# Altium project SAST_PCB_V2_Test_Beta.PrjPcb (part 1 of 2)
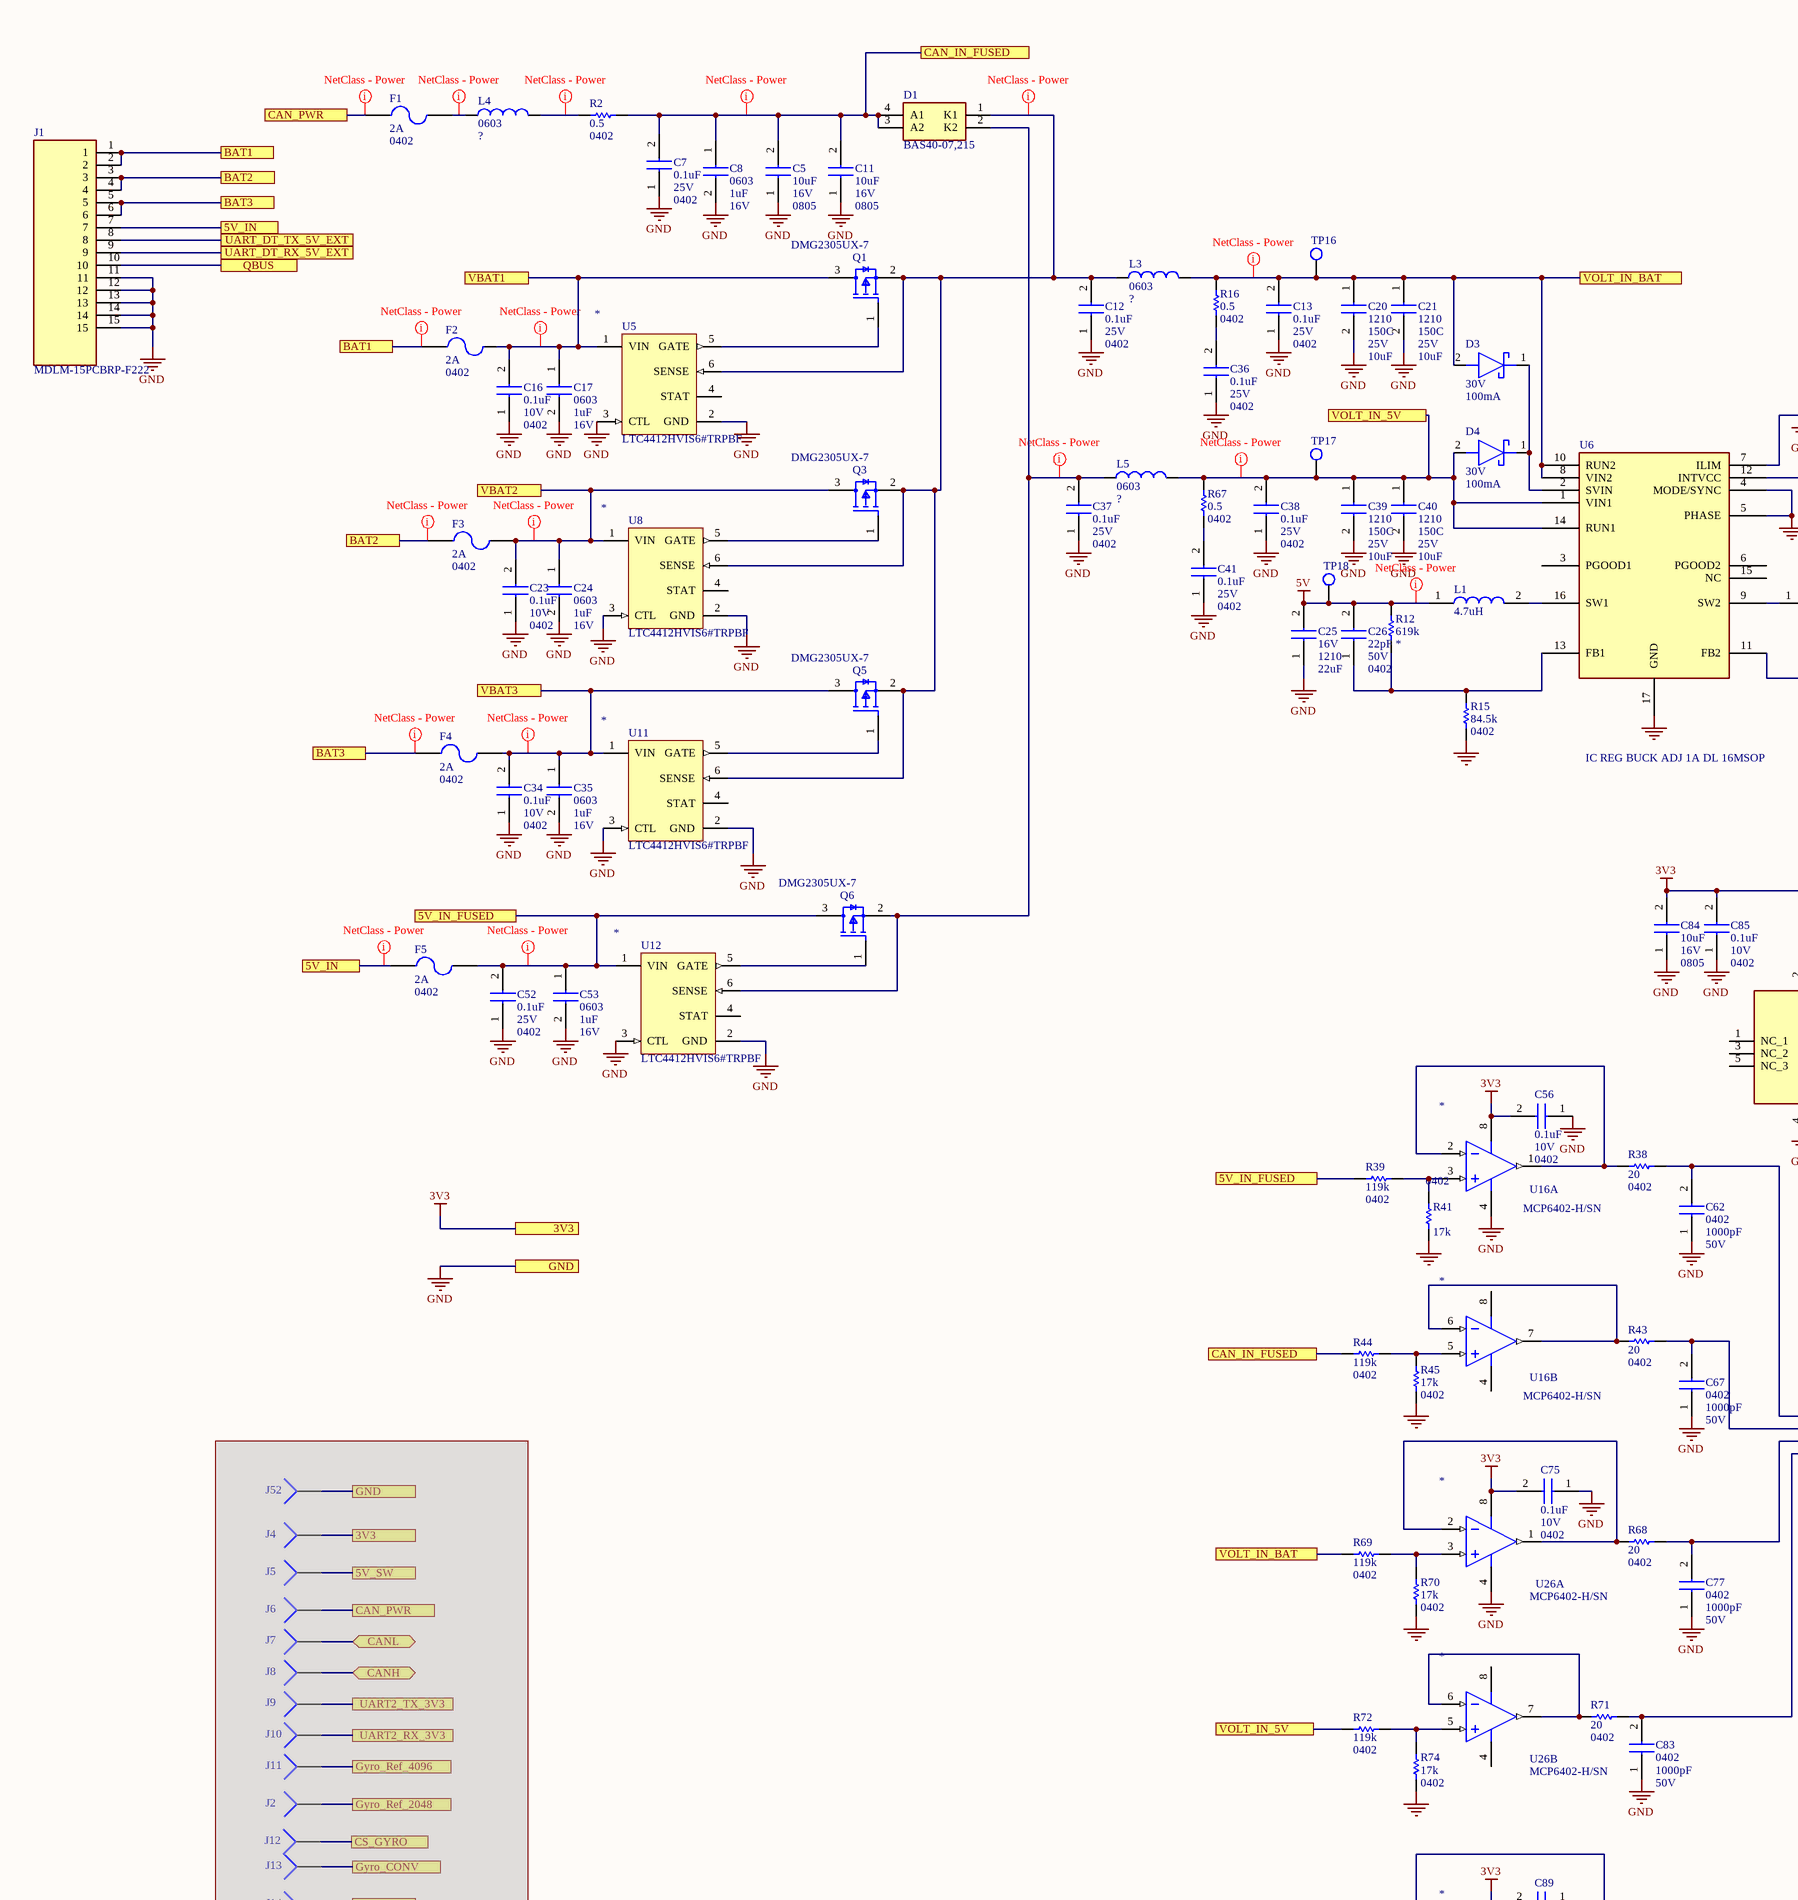
[diagram p0: SAST_PCB_V2B_Test_Beta_Main.SchDoc, top left]
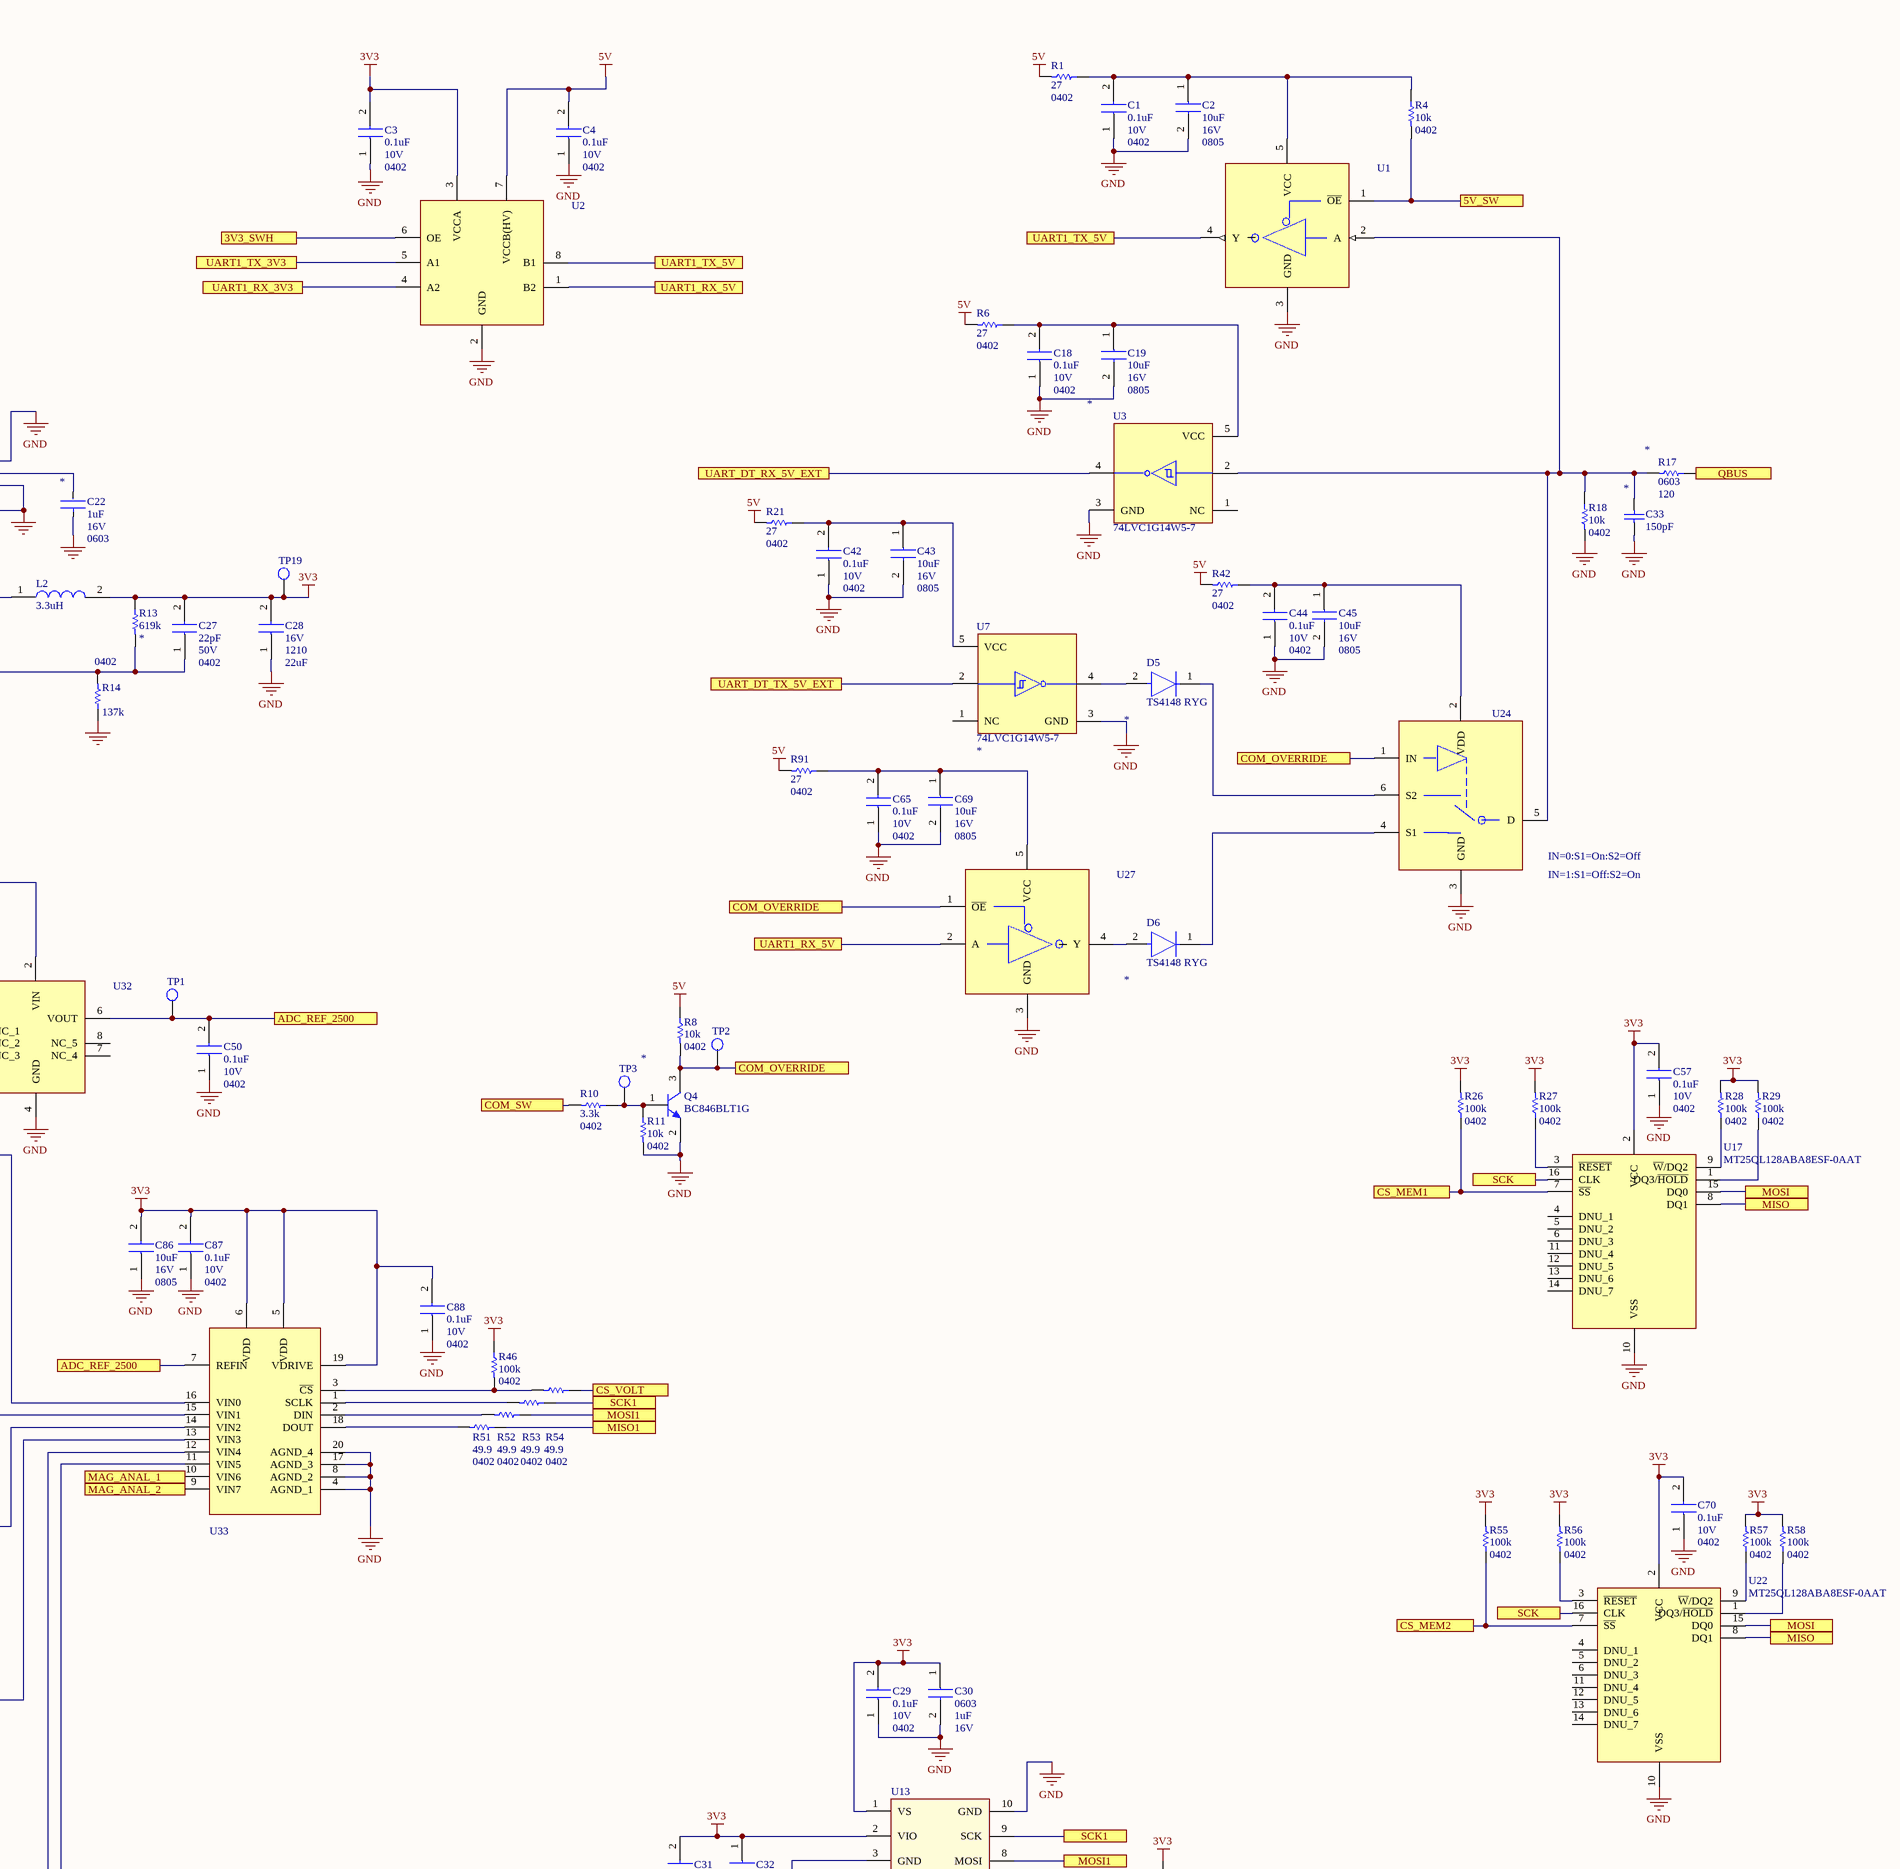
[diagram p1: SAST_PCB_V2B_Test_Beta_Main.SchDoc, top middle]
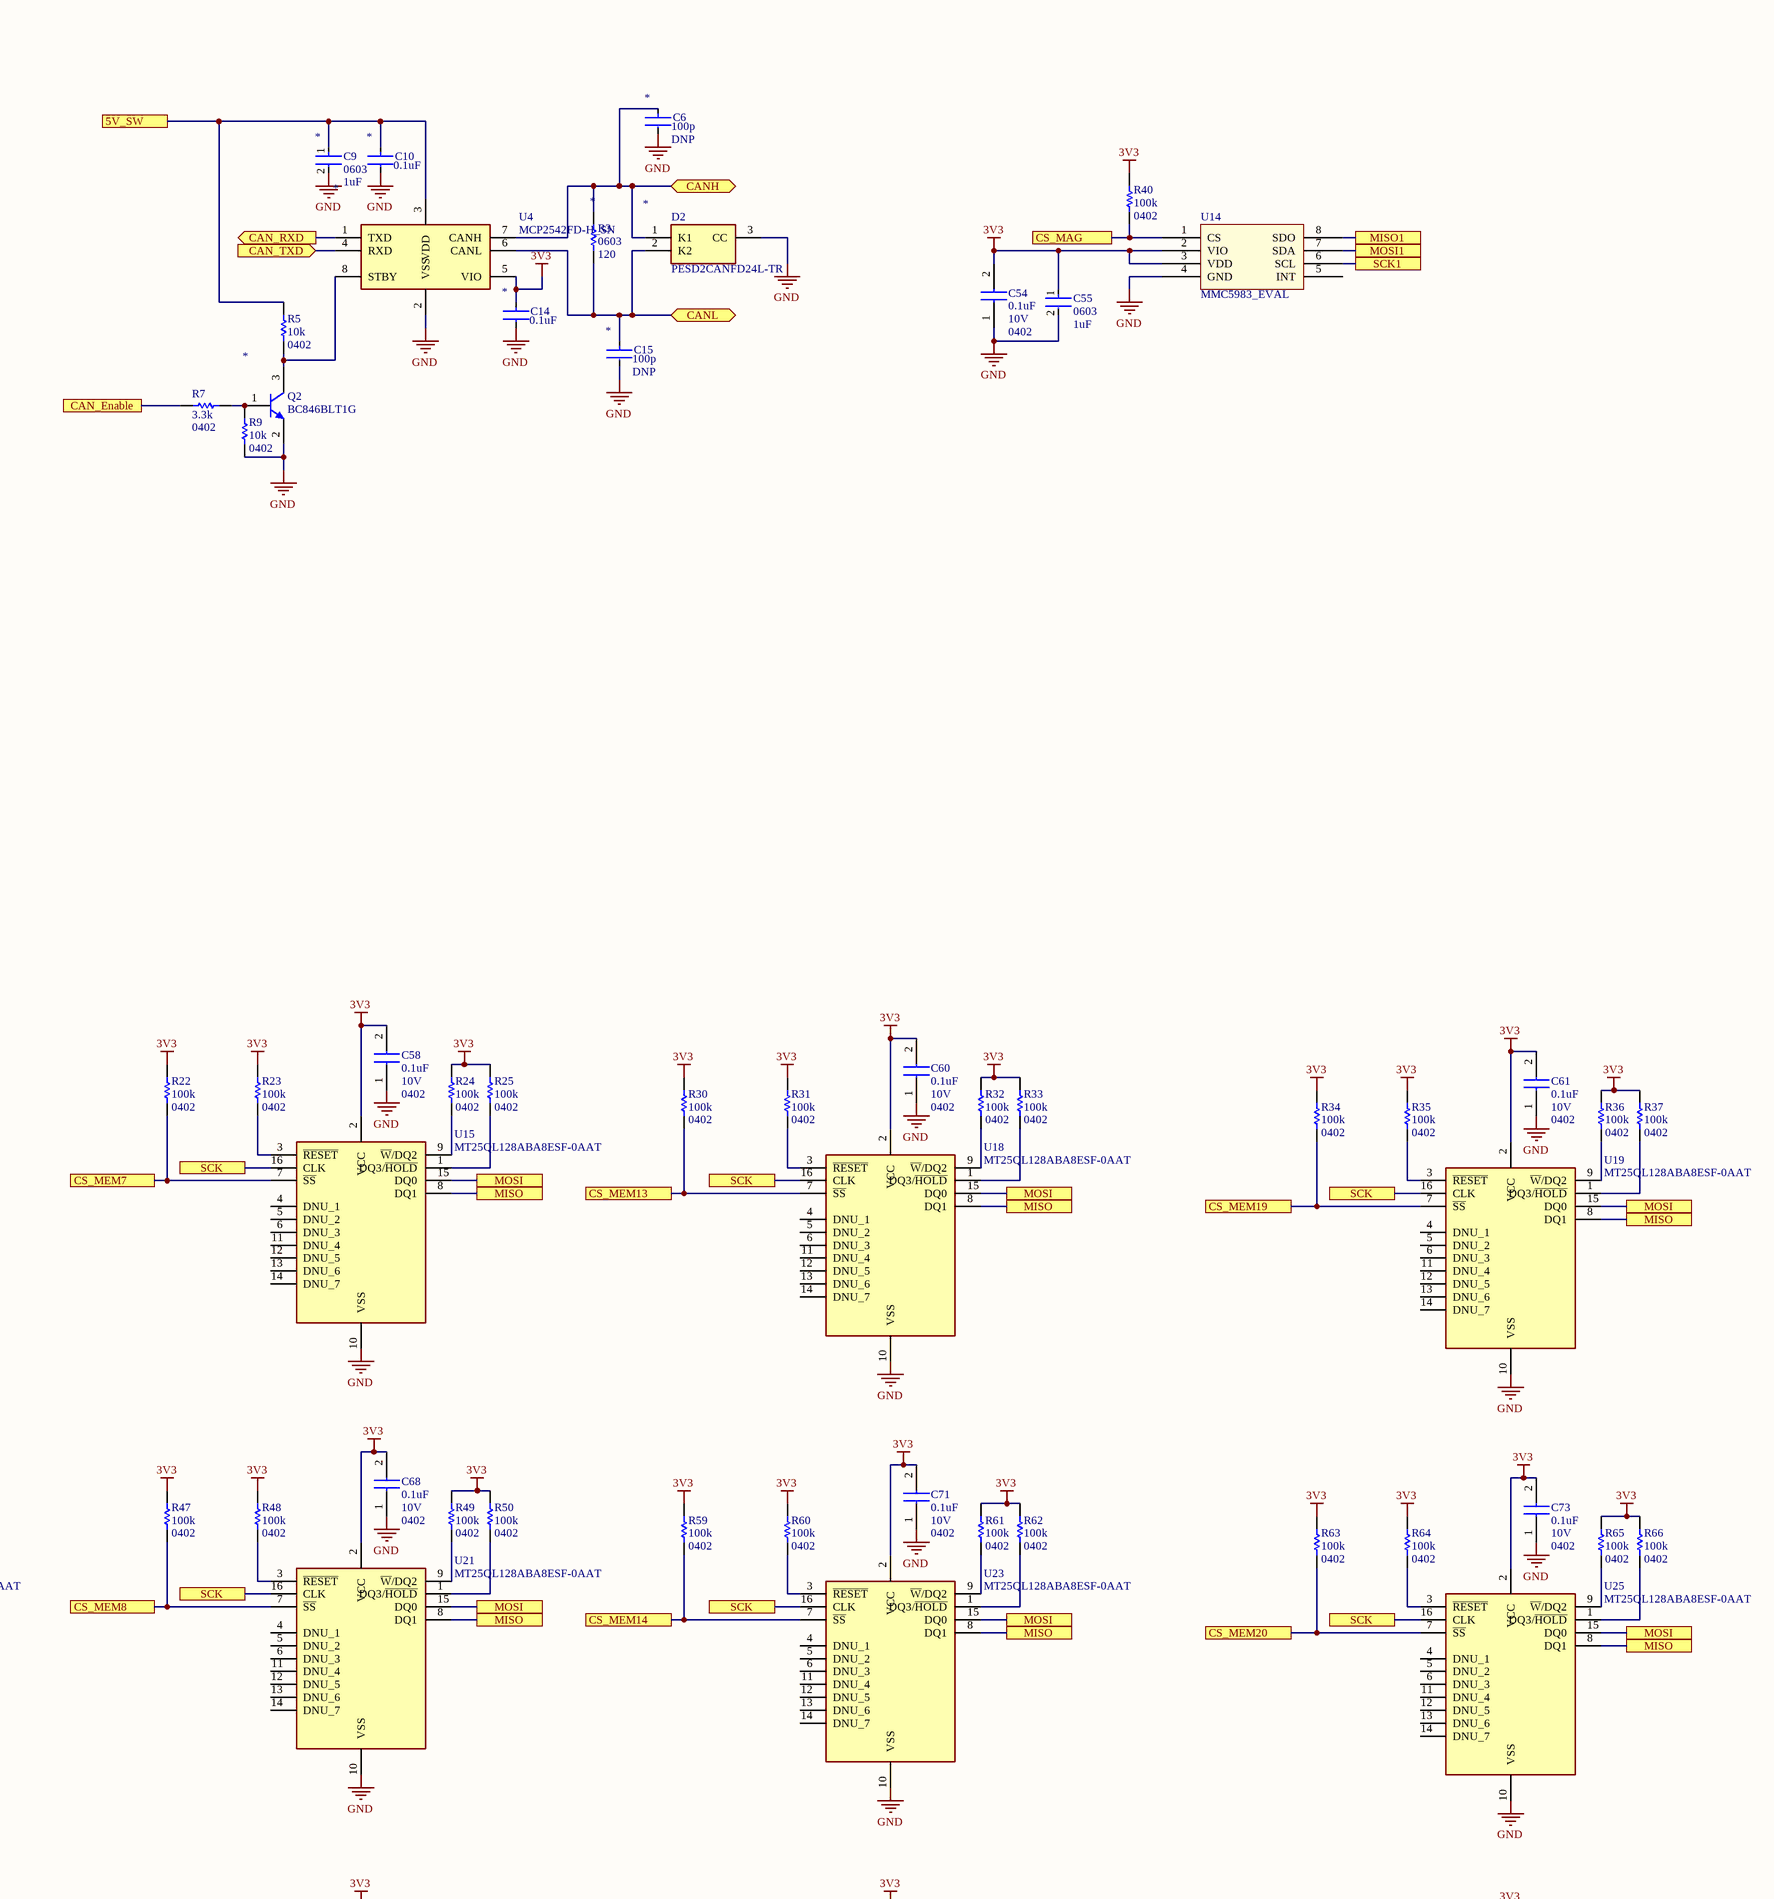
[diagram p2: SAST_PCB_V2B_Test_Beta_Main.SchDoc, top right]
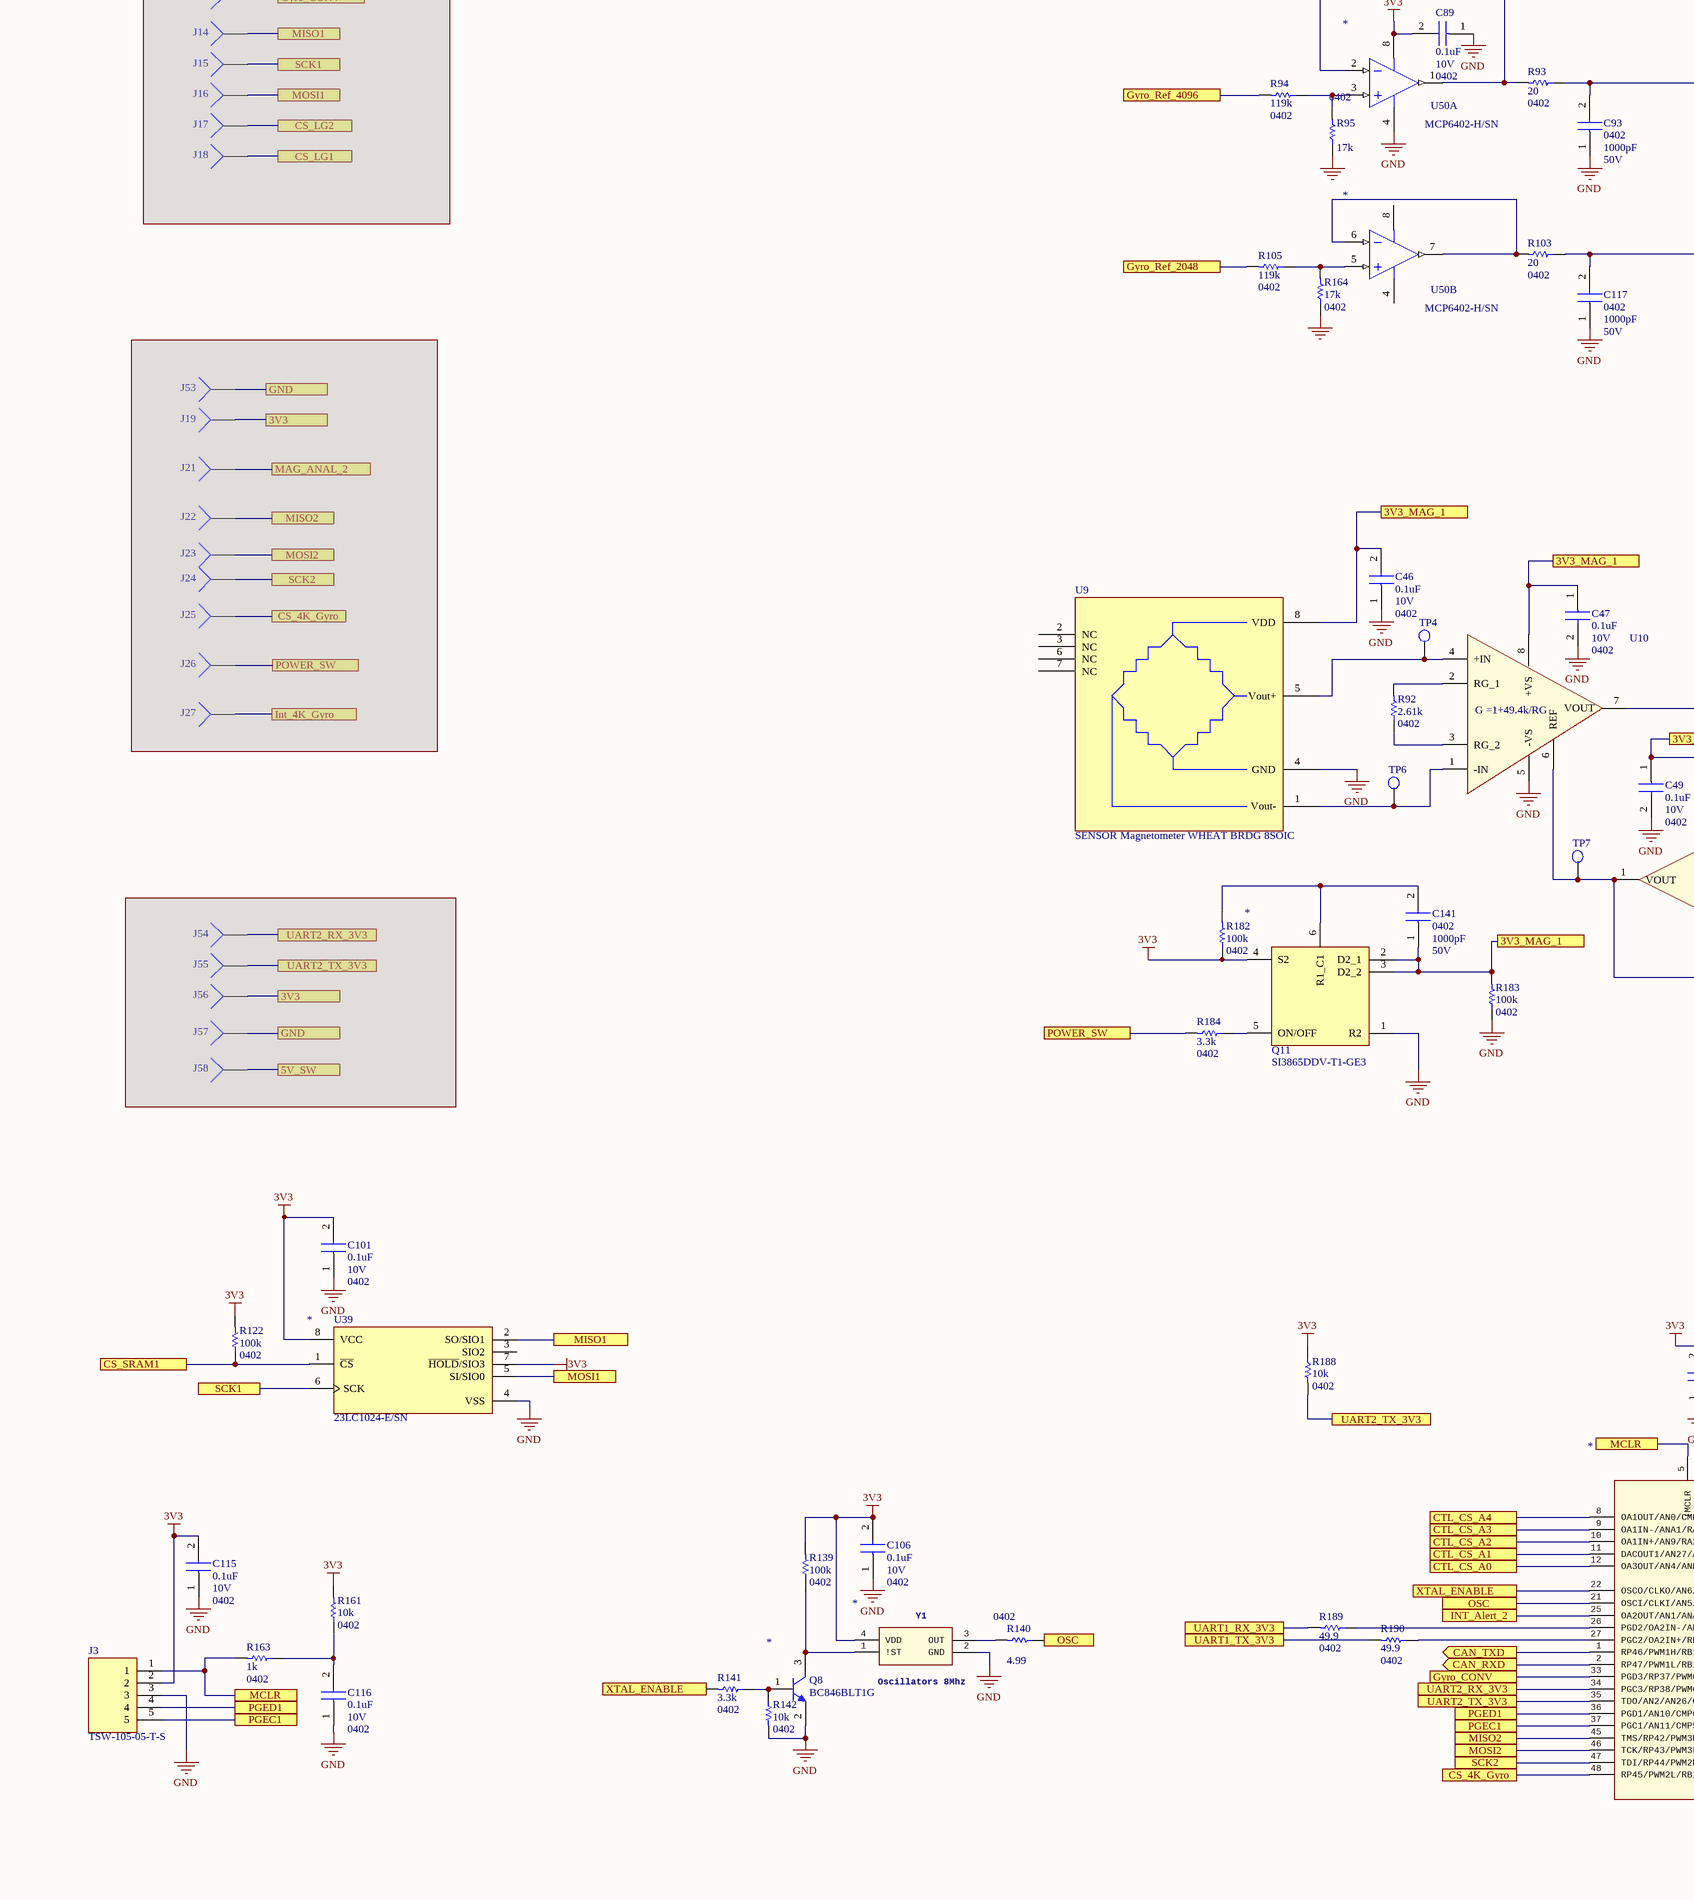
[diagram p3: SAST_PCB_V2B_Test_Beta_Main.SchDoc, bottom left]
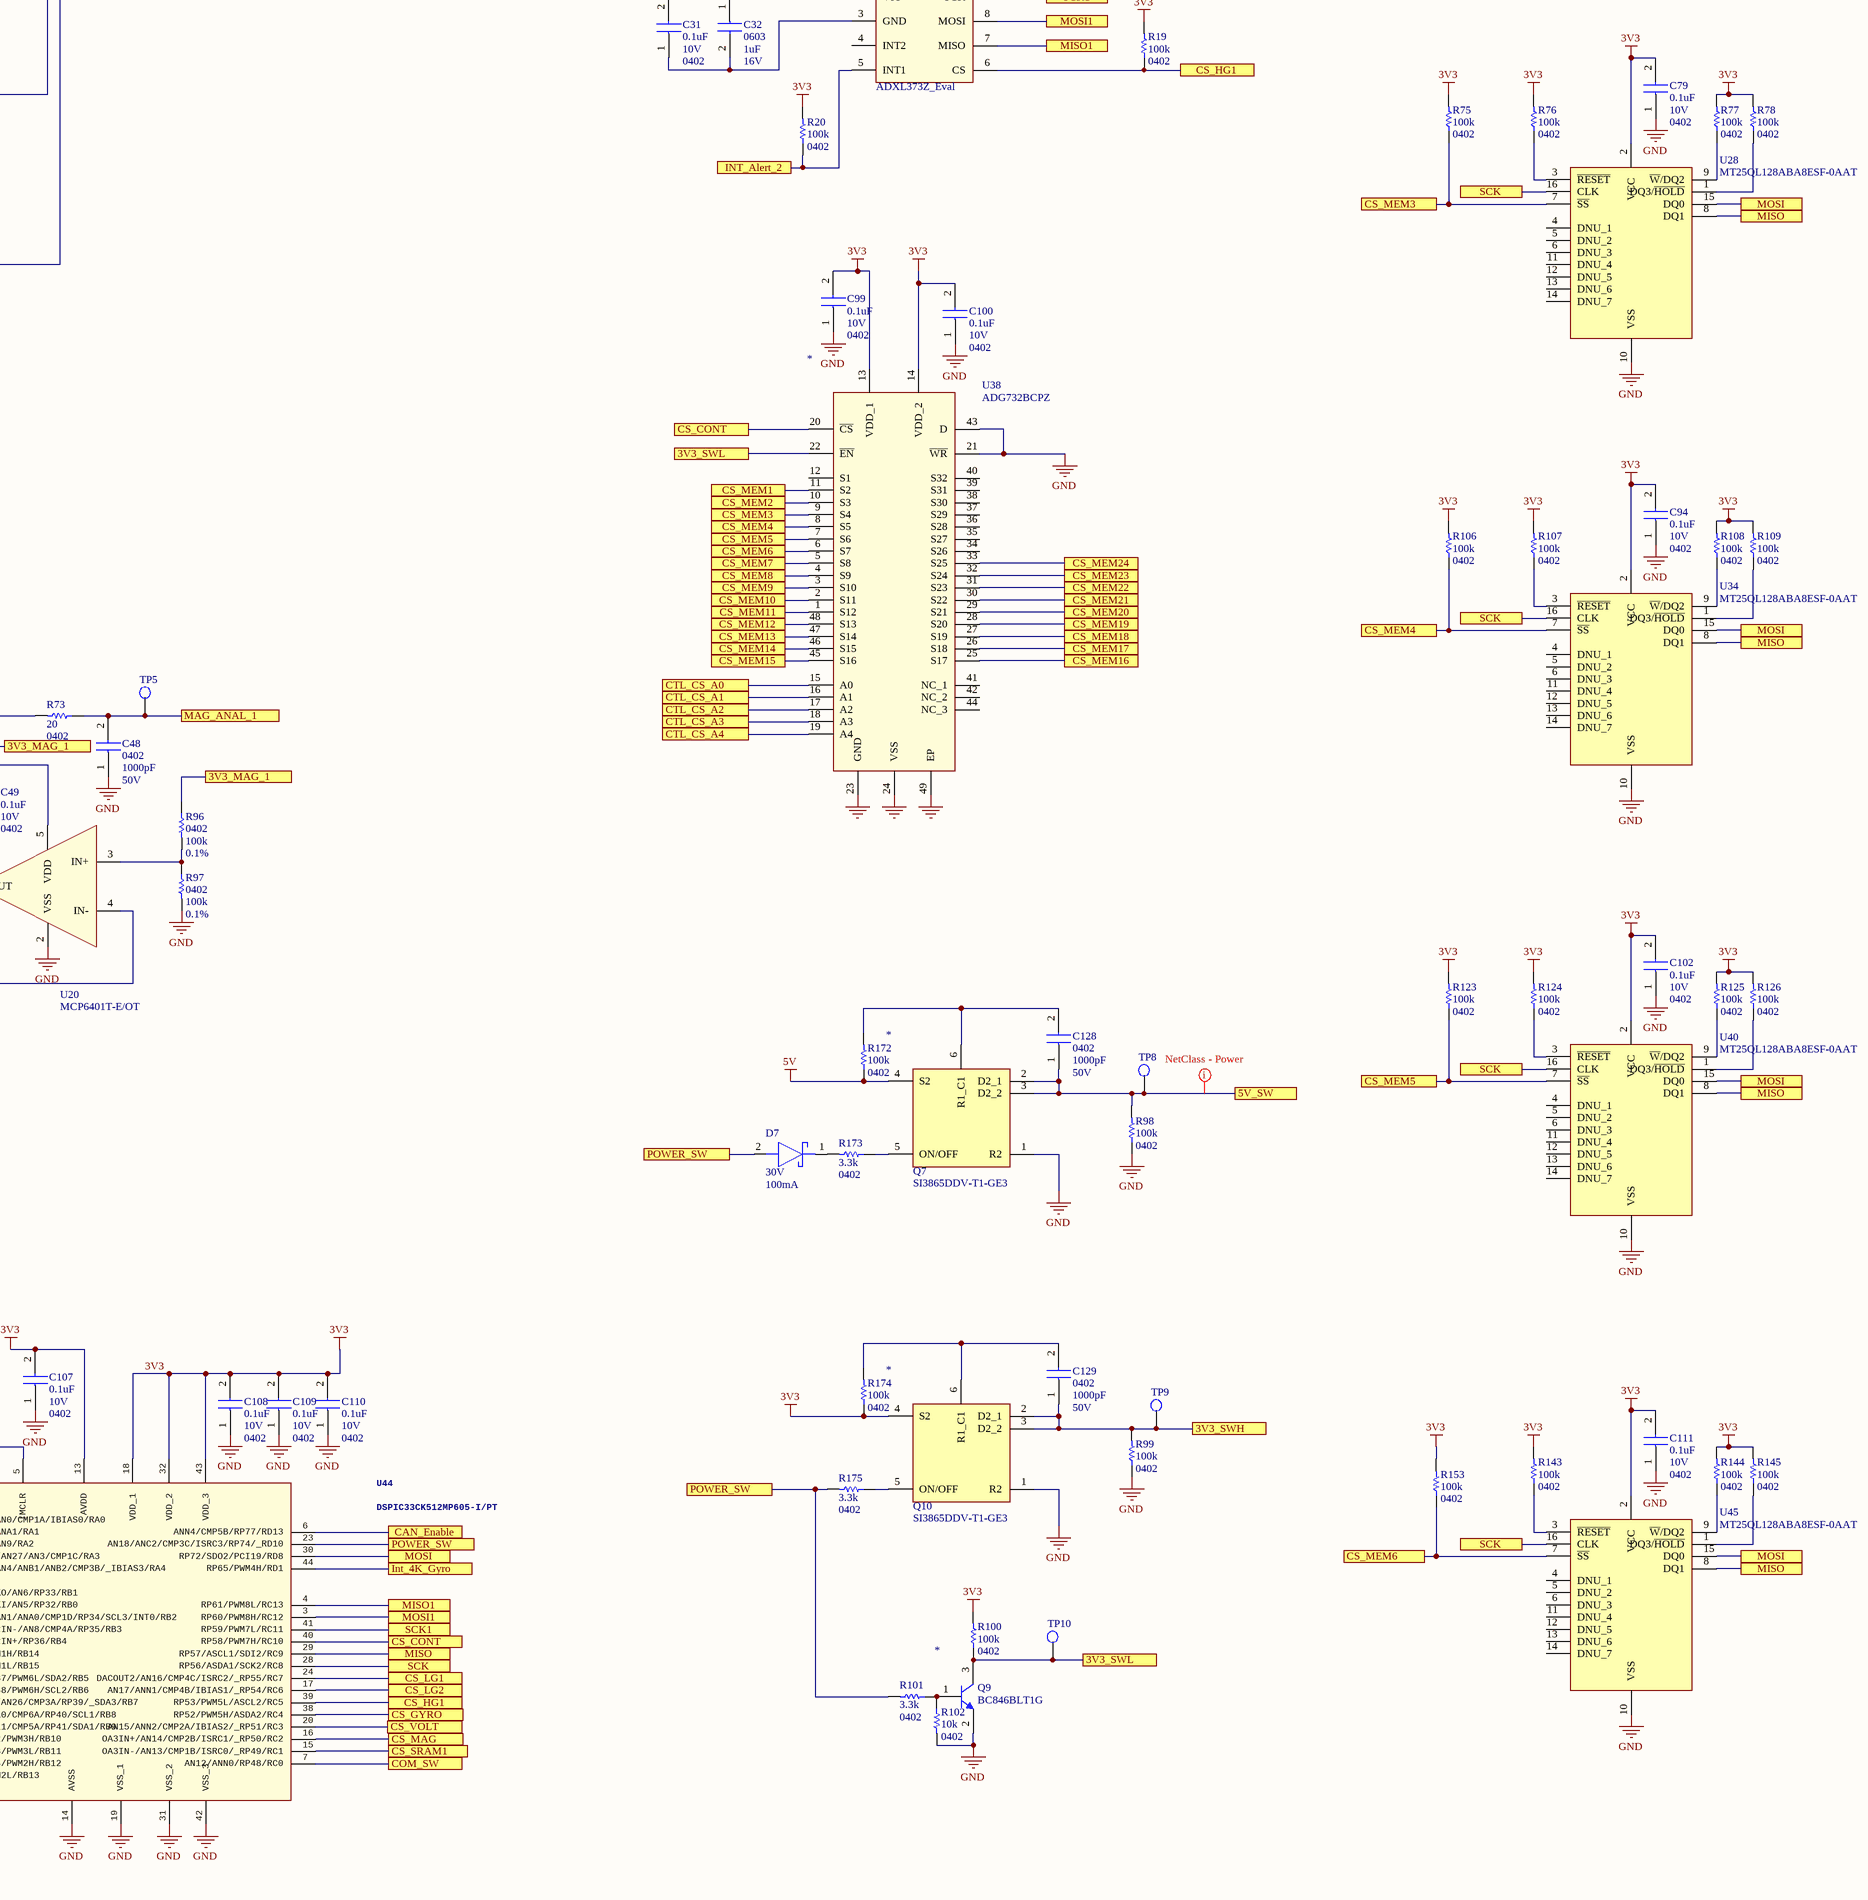
[diagram p4: SAST_PCB_V2B_Test_Beta_Main.SchDoc, bottom middle]
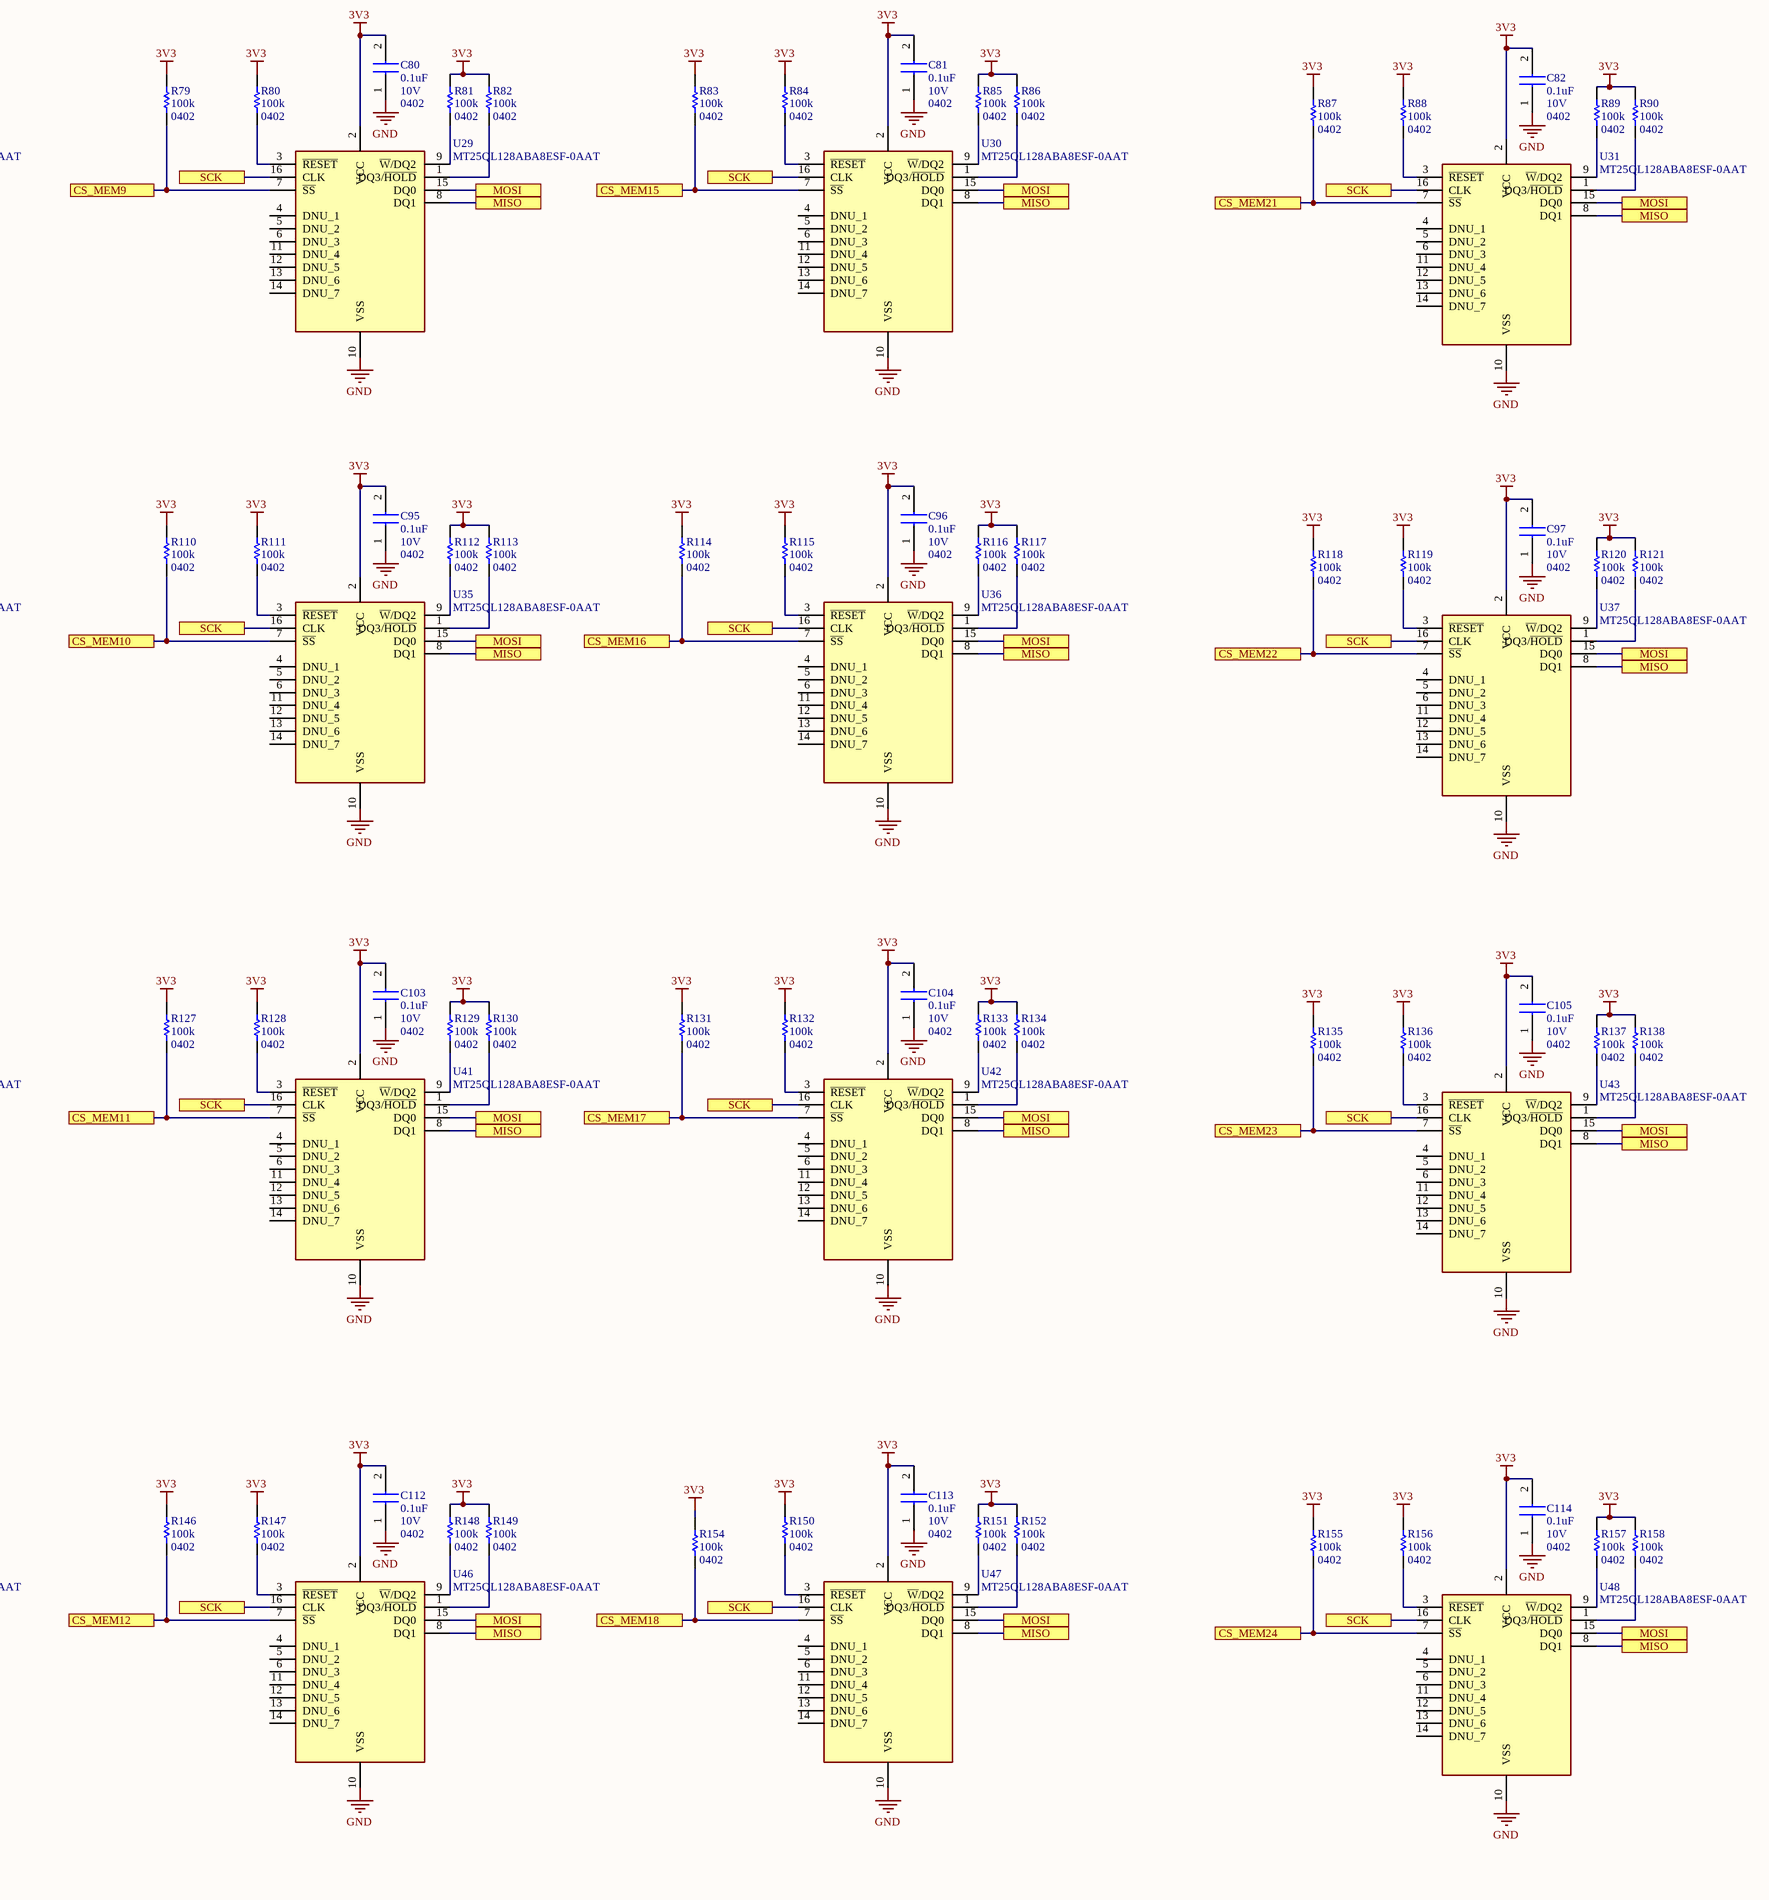
[diagram p5: SAST_PCB_V2B_Test_Beta_Main.SchDoc, bottom right]
1 sheet, 402 parts. Net scope: flat (ports and power ports of the same name join across sheets).
Board file: SAST_PCB_V2B_Test_Beta_Main.PcbDoc

## Sheet SAST_PCB_V2B_Test_Beta_Main.SchDoc
size A0; SheetNumber: 1; SheetTotal: 1; SPICEModelCacheFRIUEEDA: <root> / <DocumentId>FRIUEEDA</DocumentId> / <CacheFrame Number="0"> / <Model Name="fuse" Kind="CKT"> / <Text>.SUBCKT FUSE 1 2 PARAMS: CURRENT=1 RESISTANCE=1m / SW1 1 2 3 0 SMOD OFF / BNLV 3 0 V=(abs(v(1,2))) / .MODEL SMOD SW (VT={(CURRENT*RESISTANCE)} RON=1g ROFF={RESISTANCE}) / .ENDS FUSE</Text> / </Model> / </CacheFrame> / </root>

### Parts
C1  value 0.1uF  Voltage: 10V  Case/Package: 0402  [0402_DSP]  (hidden comment: CAP CER .1UF 10V X8M 0201)
C2  value 10uF  Voltage: 16V  Case/Package: 0805  [0805_DSP]  (hidden comment: CAP CER 10UF 16V X8M 0805)
C3  value 0.1uF  Voltage: 10V  Case/Package: 0402  [0402_DSP]  (hidden comment: CAP CER .1UF 10V X8M 0201)
C4  value 0.1uF  Voltage: 10V  Case/Package: 0402  [0402_DSP]  (hidden comment: CAP CER .1UF 10V X8M 0201)
C5  value 10uF  Voltage: 16V  Case/Package: 0805  [CAPC2012X140N]  (hidden comment: CAP CER 10UF 16V X8M 0805)
C6  value 100p  Manufacturing: DNP  [FP-GCM155-0_05-IPC_B]  (hidden comment: GCM155L81E104KE02D)
C7  value 0.1uF  Voltage: 25V  Case/Package: 0402  [0402_DSP]  (hidden comment: CAP CER 0.1UF 25V X8L 0402)
C8  value 1uF  Case/Package: 0603  Voltage: 16V  [0603_DSP]  (hidden comment: CAP CER 1UF 16V X8L 0603)
C9  0603  value 1uF  [FP-GCG188-0_2-IPC_A]
C10  value 0.1uF  [FP-GCM155-0_05-IPC_B]  (hidden comment: GCM155L81E104KE02D)
C11  value 10uF  Voltage: 16V  Case/Package: 0805  [CAPC2012X140N]  (hidden comment: CAP CER 10UF 16V X8M 0805)
C12  value 0.1uF  Voltage: 25V  Case/Package: 0402  [0402_DSP]  (hidden comment: CAP CER 0.1UF 25V X8L 0402)
C13  value 0.1uF  Voltage: 25V  Case/Package: 0402  [0402_DSP]  (hidden comment: CAP CER 0.1UF 25V X8L 0402)
C14  value 0.1uF  [FP-GCM155-0_05-IPC_B]  (hidden comment: GCM155L81E104KE02D)
C15  value 100p  Manufacturing: DNP  [FP-GCM155-0_05-IPC_B]  (hidden comment: GCM155L81E104KE02D)
C16  value 0.1uF  Voltage: 10V  Case/Package: 0402  [0402_DSP]  (hidden comment: CAP CER .1UF 10V X8M 0201)
C17  value 1uF  Case/Package: 0603  Voltage: 16V  [0603_DSP]  (hidden comment: CAP CER 1UF 16V X8L 0603)
C18  value 0.1uF  Voltage: 10V  Case/Package: 0402  [0402_DSP]  (hidden comment: CAP CER .1UF 10V X8M 0201)
C19  value 10uF  Voltage: 16V  Case/Package: 0805  [0805_DSP]  (hidden comment: CAP CER 10UF 16V X8M 0805)
C20  value 10uF  Case/Package: 1210  Temperature: 150C  Voltage: 25V  [CAPC3225X280N]  (hidden comment: CAP CER 10UF 25V X8R 1210)
C21  value 10uF  Case/Package: 1210  Temperature: 150C  Voltage: 25V  [CAPC3225X280N]  (hidden comment: CAP CER 10UF 25V X8R 1210)
C22  Capacitance: 1uF  Voltage Rating: 16V  Case Code (Imperial): 0603  [FP-C1608-080-0_1-IPC_A]  (hidden comment: C1608X8L1C105K080AC)
C23  value 0.1uF  Voltage: 10V  Case/Package: 0402  [0402_DSP]  (hidden comment: CAP CER .1UF 10V X8M 0201)
C24  value 1uF  Case/Package: 0603  Voltage: 16V  [0603_DSP]  (hidden comment: CAP CER 1UF 16V X8L 0603)
C25  value 22uF  Voltage: 16V  Case/Package: 1210  [CAPC3225X280N]  (hidden comment: CAP CER 22UF 16V X8L 1210)
C26  value 22pF  Voltage: 50V  Case/Package: 0402  [0402_DSP]  (hidden comment: CAP CER 22PF 50V C0G/NP0 0402)
C27  value 22pF  Voltage: 50V  Case/Package: 0402  [0402_DSP]  (hidden comment: CAP CER 22PF 50V C0G/NP0 0402)
C28  value 22uF  Voltage: 16V  Case/Package: 1210  [CAPC3225X280N]  (hidden comment: CAP CER 22UF 16V X8L 1210)
C29  value 0.1uF  Voltage: 10V  Case/Package: 0402  [0402_DSP]  (hidden comment: CAP CER .1UF 10V X8M 0201)
C30  value 1uF  Case/Package: 0603  Voltage: 16V  [0603_DSP]  (hidden comment: CAP CER 1UF 16V X8L 0603)
C31  value 0.1uF  Voltage: 10V  Case/Package: 0402  [0402_DSP]  (hidden comment: CAP CER .1UF 10V X8M 0201)
C32  value 1uF  Case/Package: 0603  Voltage: 16V  [0603_DSP]  (hidden comment: CAP CER 1UF 16V X8L 0603)
C33  value 150pF  [CAPC1005X60X26LL10T16]  (hidden comment: VJ0402A151JXAAC)
C34  value 0.1uF  Voltage: 10V  Case/Package: 0402  [0402_DSP]  (hidden comment: CAP CER .1UF 10V X8M 0201)
C35  value 1uF  Case/Package: 0603  Voltage: 16V  [0603_DSP]  (hidden comment: CAP CER 1UF 16V X8L 0603)
C36  value 0.1uF  Voltage: 25V  Case/Package: 0402  [0402_DSP]  (hidden comment: CAP CER 0.1UF 25V X8L 0402)
C37  value 0.1uF  Voltage: 25V  Case/Package: 0402  [0402_DSP]  (hidden comment: CAP CER 0.1UF 25V X8L 0402)
C38  value 0.1uF  Voltage: 25V  Case/Package: 0402  [0402_DSP]  (hidden comment: CAP CER 0.1UF 25V X8L 0402)
C39  value 10uF  Case/Package: 1210  Temperature: 150C  Voltage: 25V  [CAPC3225X280N]  (hidden comment: CAP CER 10UF 25V X8R 1210)
C40  value 10uF  Case/Package: 1210  Temperature: 150C  Voltage: 25V  [CAPC3225X280N]  (hidden comment: CAP CER 10UF 25V X8R 1210)
C41  value 0.1uF  Voltage: 25V  Case/Package: 0402  [0402_DSP]  (hidden comment: CAP CER 0.1UF 25V X8L 0402)
C42  value 0.1uF  Voltage: 10V  Case/Package: 0402  [0402_DSP]  (hidden comment: CAP CER .1UF 10V X8M 0201)
C43  value 10uF  Voltage: 16V  Case/Package: 0805  [0805_DSP]  (hidden comment: CAP CER 10UF 16V X8M 0805)
C44  value 0.1uF  Voltage: 10V  Case/Package: 0402  [0402_DSP]  (hidden comment: CAP CER .1UF 10V X8M 0201)
C45  value 10uF  Voltage: 16V  Case/Package: 0805  [0805_DSP]  (hidden comment: CAP CER 10UF 16V X8M 0805)
C46  value 0.1uF  Voltage: 10V  Case/Package: 0402  [0402_DSP]  (hidden comment: CAP CER .1UF 10V X8M 0201)
C47  value 0.1uF  Voltage: 10V  Case/Package: 0402  [0402_DSP]  (hidden comment: CAP CER .1UF 10V X8M 0201)
C48  value 1000pF  Case/Package: 0402  Voltage: 50V  [0402_DSP]  (hidden comment: CAP CER 1000PF 50V X8L 0402)
C49  value 0.1uF  Voltage: 10V  Case/Package: 0402  [0402_DSP]  (hidden comment: CAP CER .1UF 10V X8M 0201)
C50  value 0.1uF  Voltage: 10V  Case/Package: 0402  [0402_DSP]  (hidden comment: CAP CER .1UF 10V X8M 0201)
C52  value 0.1uF  Voltage: 25V  Case/Package: 0402  [0402_DSP]  (hidden comment: CAP CER 0.1UF 25V X8L 0402)
C53  value 1uF  Case/Package: 0603  Voltage: 16V  [0603_DSP]  (hidden comment: CAP CER 1UF 16V X8L 0603)
C54  value 0.1uF  Voltage: 10V  Case/Package: 0402  [0402_DSP]  (hidden comment: CAP CER .1UF 10V X8M 0201)
C55  0603  value 1uF  [FP-GCG188-0_2-IPC_A]
C56  value 0.1uF  Voltage: 10V  Case/Package: 0402  [0402_DSP]  (hidden comment: CAP CER .1UF 10V X8M 0201)
C57  value 0.1uF  Voltage: 10V  Case/Package: 0402  [0402_DSP]  (hidden comment: CAP CER .1UF 10V X8M 0201)
C58  value 0.1uF  Voltage: 10V  Case/Package: 0402  [0402_DSP]  (hidden comment: CAP CER .1UF 10V X8M 0201)
C60  value 0.1uF  Voltage: 10V  Case/Package: 0402  [0402_DSP]  (hidden comment: CAP CER .1UF 10V X8M 0201)
C61  value 0.1uF  Voltage: 10V  Case/Package: 0402  [0402_DSP]  (hidden comment: CAP CER .1UF 10V X8M 0201)
C62  value 1000pF  Case/Package: 0402  Voltage: 50V  [0402_DSP]  (hidden comment: CAP CER 1000PF 50V X8L 0402)
C65  value 0.1uF  Voltage: 10V  Case/Package: 0402  [0402_DSP]  (hidden comment: CAP CER .1UF 10V X8M 0201)
C67  value 1000pF  Case/Package: 0402  Voltage: 50V  [0402_DSP]  (hidden comment: CAP CER 1000PF 50V X8L 0402)
C68  value 0.1uF  Voltage: 10V  Case/Package: 0402  [0402_DSP]  (hidden comment: CAP CER .1UF 10V X8M 0201)
C69  value 10uF  Voltage: 16V  Case/Package: 0805  [0805_DSP]  (hidden comment: CAP CER 10UF 16V X8M 0805)
C70  value 0.1uF  Voltage: 10V  Case/Package: 0402  [0402_DSP]  (hidden comment: CAP CER .1UF 10V X8M 0201)
C71  value 0.1uF  Voltage: 10V  Case/Package: 0402  [0402_DSP]  (hidden comment: CAP CER .1UF 10V X8M 0201)
C73  value 0.1uF  Voltage: 10V  Case/Package: 0402  [0402_DSP]  (hidden comment: CAP CER .1UF 10V X8M 0201)
C75  value 0.1uF  Voltage: 10V  Case/Package: 0402  [0402_DSP]  (hidden comment: CAP CER .1UF 10V X8M 0201)
C77  value 1000pF  Case/Package: 0402  Voltage: 50V  [0402_DSP]  (hidden comment: CAP CER 1000PF 50V X8L 0402)
C79  value 0.1uF  Voltage: 10V  Case/Package: 0402  [0402_DSP]  (hidden comment: CAP CER .1UF 10V X8M 0201)
C80  value 0.1uF  Voltage: 10V  Case/Package: 0402  [0402_DSP]  (hidden comment: CAP CER .1UF 10V X8M 0201)
C81  value 0.1uF  Voltage: 10V  Case/Package: 0402  [0402_DSP]  (hidden comment: CAP CER .1UF 10V X8M 0201)
C82  value 0.1uF  Voltage: 10V  Case/Package: 0402  [0402_DSP]  (hidden comment: CAP CER .1UF 10V X8M 0201)
C83  value 1000pF  Case/Package: 0402  Voltage: 50V  [0402_DSP]  (hidden comment: CAP CER 1000PF 50V X8L 0402)
C84  value 10uF  Voltage: 16V  Case/Package: 0805  [CAPC2012X140N]  (hidden comment: CAP CER 10UF 16V X8M 0805)
C85  value 0.1uF  Voltage: 10V  Case/Package: 0402  [0402_DSP]  (hidden comment: CAP CER .1UF 10V X8M 0201)
C86  value 10uF  Voltage: 16V  Case/Package: 0805  [CAPC2012X140N]  (hidden comment: CAP CER 10UF 16V X8M 0805)
C87  value 0.1uF  Voltage: 10V  Case/Package: 0402  [0402_DSP]  (hidden comment: CAP CER .1UF 10V X8M 0201)
C88  value 0.1uF  Voltage: 10V  Case/Package: 0402  [0402_DSP]  (hidden comment: CAP CER .1UF 10V X8M 0201)
C89  value 0.1uF  Voltage: 10V  Case/Package: 0402  [0402_DSP]  (hidden comment: CAP CER .1UF 10V X8M 0201)
C93  value 1000pF  Case/Package: 0402  Voltage: 50V  [0402_DSP]  (hidden comment: CAP CER 1000PF 50V X8L 0402)
C94  value 0.1uF  Voltage: 10V  Case/Package: 0402  [0402_DSP]  (hidden comment: CAP CER .1UF 10V X8M 0201)
C95  value 0.1uF  Voltage: 10V  Case/Package: 0402  [0402_DSP]  (hidden comment: CAP CER .1UF 10V X8M 0201)
C96  value 0.1uF  Voltage: 10V  Case/Package: 0402  [0402_DSP]  (hidden comment: CAP CER .1UF 10V X8M 0201)
C97  value 0.1uF  Voltage: 10V  Case/Package: 0402  [0402_DSP]  (hidden comment: CAP CER .1UF 10V X8M 0201)
C99  value 0.1uF  Voltage: 10V  Case/Package: 0402  [0402_DSP]  (hidden comment: CAP CER .1UF 10V X8M 0201)
C100  value 0.1uF  Voltage: 10V  Case/Package: 0402  [0402_DSP]  (hidden comment: CAP CER .1UF 10V X8M 0201)
C101  value 0.1uF  Voltage: 10V  Case/Package: 0402  [0402_DSP]  (hidden comment: CAP CER .1UF 10V X8M 0201)
C102  value 0.1uF  Voltage: 10V  Case/Package: 0402  [0402_DSP]  (hidden comment: CAP CER .1UF 10V X8M 0201)
C103  value 0.1uF  Voltage: 10V  Case/Package: 0402  [0402_DSP]  (hidden comment: CAP CER .1UF 10V X8M 0201)
C104  value 0.1uF  Voltage: 10V  Case/Package: 0402  [0402_DSP]  (hidden comment: CAP CER .1UF 10V X8M 0201)
C105  value 0.1uF  Voltage: 10V  Case/Package: 0402  [0402_DSP]  (hidden comment: CAP CER .1UF 10V X8M 0201)
C106  value 0.1uF  Voltage: 10V  Case/Package: 0402  [0402_DSP]  (hidden comment: CAP CER .1UF 10V X8M 0201)
C107  value 0.1uF  Voltage: 10V  Case/Package: 0402  [0402_DSP]  (hidden comment: CAP CER .1UF 10V X8M 0201)
C108  value 0.1uF  Voltage: 10V  Case/Package: 0402  [0402_DSP]  (hidden comment: CAP CER .1UF 10V X8M 0201)
C109  value 0.1uF  Voltage: 10V  Case/Package: 0402  [0402_DSP]  (hidden comment: CAP CER .1UF 10V X8M 0201)
C110  value 0.1uF  Voltage: 10V  Case/Package: 0402  [0402_DSP]  (hidden comment: CAP CER .1UF 10V X8M 0201)
C111  value 0.1uF  Voltage: 10V  Case/Package: 0402  [0402_DSP]  (hidden comment: CAP CER .1UF 10V X8M 0201)
C112  value 0.1uF  Voltage: 10V  Case/Package: 0402  [0402_DSP]  (hidden comment: CAP CER .1UF 10V X8M 0201)
C113  value 0.1uF  Voltage: 10V  Case/Package: 0402  [0402_DSP]  (hidden comment: CAP CER .1UF 10V X8M 0201)
C114  value 0.1uF  Voltage: 10V  Case/Package: 0402  [0402_DSP]  (hidden comment: CAP CER .1UF 10V X8M 0201)
C115  value 0.1uF  Voltage: 10V  Case/Package: 0402  [0402_DSP]  (hidden comment: CAP CER .1UF 10V X8M 0201)
C116  value 0.1uF  Voltage: 10V  Case/Package: 0402  [0402_DSP]  (hidden comment: CAP CER .1UF 10V X8M 0201)
C117  value 1000pF  Case/Package: 0402  Voltage: 50V  [0402_DSP]  (hidden comment: CAP CER 1000PF 50V X8L 0402)
C128  value 1000pF  Case/Package: 0402  Voltage: 50V  [0402_DSP]  (hidden comment: CAP CER 1000PF 50V X8L 0402)
C129  value 1000pF  Case/Package: 0402  Voltage: 50V  [0402_DSP]  (hidden comment: CAP CER 1000PF 50V X8L 0402)
C141  value 1000pF  Case/Package: 0402  Voltage: 50V  [0402_DSP]  (hidden comment: CAP CER 1000PF 50V X8L 0402)
D1  BAS40-07,215  [BAS4007215]
D2  PESD2CANFD24L-TR  [SOT95P230X110-3N]
D3  Voltage: 30V  Current: 100mA  [RB521CS30FHT2RA]  (hidden comment: DIODE SCHOTTKY 30V 100MA VMN2)
D4  Voltage: 30V  Current: 100mA  [RB521CS30FHT2RA]  (hidden comment: DIODE SCHOTTKY 30V 100MA VMN2)
D5  TS4148 RYG  [FP-TS4148_RYG-MFG]
D6  TS4148 RYG  [FP-TS4148_RYG-MFG]
D7  Voltage: 30V  Current: 100mA  [RB521CS30FHT2RA]  (hidden comment: DIODE SCHOTTKY 30V 100MA VMN2)
F1  2A  Case/Package: 0402  [0402_DSP]
F2  2A  Case/Package: 0402  [0402_DSP]
F3  2A  Case/Package: 0402  [0402_DSP]
F4  2A  Case/Package: 0402  [0402_DSP]
F5  2A  Case/Package: 0402  [0402_DSP]
J1  MDLM-15PCBRP-F222  [MDLM-15PCBRP-F222]
J2  (no value)  [Wire24Awg2x1HPAD]
J3  TSW-105-05-T-S  [Surface_Mount_PIC_Prog]
J4  (no value)  [Wire24Awg2x1HPAD]
J5  (no value)  [Wire24Awg2x1HPAD]
J6  (no value)  [Wire24Awg2x1HPAD]
J7  (no value)  [Wire24Awg2x1HPAD]
J8  (no value)  [Wire24Awg2x1HPAD]
J9  (no value)  [Wire24Awg2x1HPAD]
J10  (no value)  [Wire24Awg2x1HPAD]
J11  (no value)  [Wire24Awg2x1HPAD]
J12  (no value)  [Wire24Awg2x1HPAD]
J13  (no value)  [Wire24Awg2x1HPAD]
J14  (no value)  [Wire24Awg2x1HPAD]
J15  (no value)  [Wire24Awg2x1HPAD]
J16  (no value)  [Wire24Awg2x1HPAD]
J17  (no value)  [Wire24Awg2x1HPAD]
J18  (no value)  [Wire24Awg2x1HPAD]
J19  (no value)  [Wire24Awg2x1HPAD]
J21  (no value)  [Wire24Awg2x1HPAD]
J22  (no value)  [Wire24Awg2x1HPAD]
J23  (no value)  [Wire24Awg2x1HPAD]
J24  (no value)  [Wire24Awg2x1HPAD]
J25  (no value)  [Wire24Awg2x1HPAD]
J26  (no value)  [Wire24Awg2x1HPAD]
J27  (no value)  [Wire24Awg2x1HPAD]
J52  (no value)  [Wire24Awg2x1HPAD]
J53  (no value)  [Wire24Awg2x1HPAD]
J54  (no value)  [Wire24Awg2x1HPAD]
J55  (no value)  [Wire24Awg2x1HPAD]
J56  (no value)  [Wire24Awg2x1HPAD]
J57  (no value)  [Wire24Awg2x1HPAD]
J58  (no value)  [Wire24Awg2x1HPAD]
L1  value 4.7uH  [INDPM4441X200N]  (hidden comment: IHLP1616BZER4R7M5A)
L2  value 3.3uH  [IHLP2020BZER3R3M01]  (hidden comment: FIXED IND 3.3UH 4A 74.9 MOHM SMD)
L3  PackageReference: 0603  [0603_DSP]  (hidden comment: Inductor)
L4  PackageReference: 0603  [0603_DSP]  (hidden comment: Inductor)
L5  PackageReference: 0603  [0603_DSP]  (hidden comment: Inductor)
Q1  DMG2305UX-7  [FP-SOT23-IPC_B]
Q2  BC846BLT1G  [ONSC-SOT-23-3-318-08_V]
Q3  DMG2305UX-7  [FP-SOT23-IPC_B]
Q4  BC846BLT1G  [ONSC-SOT-23-3-318-08_V]
Q5  DMG2305UX-7  [FP-SOT23-IPC_B]
Q6  DMG2305UX-7  [FP-SOT23-IPC_B]
Q7  SI3865DDV-T1-GE3  [SOP95P284X110-6N]
Q8  BC846BLT1G  [ONSC-SOT-23-3-318-08_V]
Q9  BC846BLT1G  [ONSC-SOT-23-3-318-08_V]
Q10  SI3865DDV-T1-GE3  [SOP95P284X110-6N]
Q11  SI3865DDV-T1-GE3  [SOP95P284X110-6N]
R1  value 27  Case/Package: 0402  [0402_DSP]
R2  value 0.5  Case/Package: 0402  [0402_DSP]
R3  0603  value 120  [0603_DSP]
R4  value 10k  Case/Package: 0402  [0402_DSP]
R5  value 10k  Case/Package: 0402  [0402_DSP]
R6  value 27  Case/Package: 0402  [0402_DSP]
R7  value 3.3k  Case/Package: 0402  [0402_DSP]
R8  value 10k  Case/Package: 0402  [0402_DSP]
R9  value 10k  Case/Package: 0402  [0402_DSP]
R10  value 3.3k  Case/Package: 0402  [0402_DSP]
R11  value 10k  Case/Package: 0402  [0402_DSP]
R12  value 619k  [RESC1005X40X25NL05T05]  (hidden comment: CRCW0402619KFKTD)
R13  value 619k  [RESC1005X40X25NL05T05]  (hidden comment: CRCW0402619KFKTD)
R14  value 137k  Case/Package: 0402  [0402_DSP]
R15  value 84.5k  Case/Package: 0402  [0402_DSP]
R16  value 0.5  Case/Package: 0402  [0402_DSP]
R17  0603  value 120  [0603_DSP]
R18  value 10k  Case/Package: 0402  [0402_DSP]
R19  value 100k  Case/Package: 0402  [0402_DSP]
R20  value 100k  Case/Package: 0402  [0402_DSP]
R21  value 27  Case/Package: 0402  [0402_DSP]
R22  value 100k  Case/Package: 0402  [0402_DSP]
R23  value 100k  Case/Package: 0402  [0402_DSP]
R24  value 100k  Case/Package: 0402  [0402_DSP]
R25  value 100k  Case/Package: 0402  [0402_DSP]
R26  value 100k  Case/Package: 0402  [0402_DSP]
R27  value 100k  Case/Package: 0402  [0402_DSP]
R28  value 100k  Case/Package: 0402  [0402_DSP]
R29  value 100k  Case/Package: 0402  [0402_DSP]
R30  value 100k  Case/Package: 0402  [0402_DSP]
R31  value 100k  Case/Package: 0402  [0402_DSP]
R32  value 100k  Case/Package: 0402  [0402_DSP]
R33  value 100k  Case/Package: 0402  [0402_DSP]
R34  value 100k  Case/Package: 0402  [0402_DSP]
R35  value 100k  Case/Package: 0402  [0402_DSP]
R36  value 100k  Case/Package: 0402  [0402_DSP]
R37  value 100k  Case/Package: 0402  [0402_DSP]
R38  value 20  Case/Package: 0402  [0402_DSP]
R39  value 119k  Case/Package: 0402  [0402_DSP]
R40  value 100k  Case/Package: 0402  [0402_DSP]
R41  value 17k  Case/Package: 0402  [0402_DSP]
R42  value 27  Case/Package: 0402  [0402_DSP]
R43  value 20  Case/Package: 0402  [0402_DSP]
R44  value 119k  Case/Package: 0402  [0402_DSP]
R45  value 17k  Case/Package: 0402  [0402_DSP]
R46  value 100k  Case/Package: 0402  [0402_DSP]
R47  value 100k  Case/Package: 0402  [0402_DSP]
R48  value 100k  Case/Package: 0402  [0402_DSP]
R49  value 100k  Case/Package: 0402  [0402_DSP]
R50  value 100k  Case/Package: 0402  [0402_DSP]
R51  value 49.9  Case/Package: 0402  [0402_DSP]
R52  value 49.9  Case/Package: 0402  [0402_DSP]
R53  value 49.9  Case/Package: 0402  [0402_DSP]
R54  value 49.9  Case/Package: 0402  [0402_DSP]
R55  value 100k  Case/Package: 0402  [0402_DSP]
R56  value 100k  Case/Package: 0402  [0402_DSP]
R57  value 100k  Case/Package: 0402  [0402_DSP]
R58  value 100k  Case/Package: 0402  [0402_DSP]
R59  value 100k  Case/Package: 0402  [0402_DSP]
R60  value 100k  Case/Package: 0402  [0402_DSP]
R61  value 100k  Case/Package: 0402  [0402_DSP]
R62  value 100k  Case/Package: 0402  [0402_DSP]
R63  value 100k  Case/Package: 0402  [0402_DSP]
R64  value 100k  Case/Package: 0402  [0402_DSP]
R65  value 100k  Case/Package: 0402  [0402_DSP]
R66  value 100k  Case/Package: 0402  [0402_DSP]
R67  value 0.5  Case/Package: 0402  [0402_DSP]
R68  value 20  Case/Package: 0402  [0402_DSP]
R69  value 119k  Case/Package: 0402  [0402_DSP]
R70  value 17k  Case/Package: 0402  [0402_DSP]
R71  value 20  Case/Package: 0402  [0402_DSP]
R72  value 119k  Case/Package: 0402  [0402_DSP]
R73  value 20  Case/Package: 0402  [0402_DSP]
R74  value 17k  Case/Package: 0402  [0402_DSP]
R75  value 100k  Case/Package: 0402  [0402_DSP]
R76  value 100k  Case/Package: 0402  [0402_DSP]
R77  value 100k  Case/Package: 0402  [0402_DSP]
R78  value 100k  Case/Package: 0402  [0402_DSP]
R79  value 100k  Case/Package: 0402  [0402_DSP]
R80  value 100k  Case/Package: 0402  [0402_DSP]
R81  value 100k  Case/Package: 0402  [0402_DSP]
R82  value 100k  Case/Package: 0402  [0402_DSP]
R83  value 100k  Case/Package: 0402  [0402_DSP]
R84  value 100k  Case/Package: 0402  [0402_DSP]
R85  value 100k  Case/Package: 0402  [0402_DSP]
R86  value 100k  Case/Package: 0402  [0402_DSP]
R87  value 100k  Case/Package: 0402  [0402_DSP]
R88  value 100k  Case/Package: 0402  [0402_DSP]
R89  value 100k  Case/Package: 0402  [0402_DSP]
R90  value 100k  Case/Package: 0402  [0402_DSP]
R91  value 27  Case/Package: 0402  [0402_DSP]
R92  value 2.61k  Case/Package: 0402  [0402_DSP]
R93  value 20  Case/Package: 0402  [0402_DSP]
R94  value 119k  Case/Package: 0402  [0402_DSP]
R95  value 17k  Case/Package: 0402  [0402_DSP]
R96  0402  value 100k  Tolerance: 0.1%  [0402_DSP]
R97  0402  value 100k  Tolerance: 0.1%  [0402_DSP]
R98  value 100k  Case/Package: 0402  [0402_DSP]
R99  value 100k  Case/Package: 0402  [0402_DSP]
R100  value 100k  Case/Package: 0402  [0402_DSP]
R101  value 3.3k  Case/Package: 0402  [0402_DSP]
R102  value 10k  Case/Package: 0402  [0402_DSP]
R103  value 20  Case/Package: 0402  [0402_DSP]
R105  value 119k  Case/Package: 0402  [0402_DSP]
R106  value 100k  Case/Package: 0402  [0402_DSP]
R107  value 100k  Case/Package: 0402  [0402_DSP]
R108  value 100k  Case/Package: 0402  [0402_DSP]
R109  value 100k  Case/Package: 0402  [0402_DSP]
R110  value 100k  Case/Package: 0402  [0402_DSP]
R111  value 100k  Case/Package: 0402  [0402_DSP]
R112  value 100k  Case/Package: 0402  [0402_DSP]
R113  value 100k  Case/Package: 0402  [0402_DSP]
R114  value 100k  Case/Package: 0402  [0402_DSP]
R115  value 100k  Case/Package: 0402  [0402_DSP]
R116  value 100k  Case/Package: 0402  [0402_DSP]
R117  value 100k  Case/Package: 0402  [0402_DSP]
R118  value 100k  Case/Package: 0402  [0402_DSP]
R119  value 100k  Case/Package: 0402  [0402_DSP]
R120  value 100k  Case/Package: 0402  [0402_DSP]
R121  value 100k  Case/Package: 0402  [0402_DSP]
R122  value 100k  Case/Package: 0402  [0402_DSP]
R123  value 100k  Case/Package: 0402  [0402_DSP]
R124  value 100k  Case/Package: 0402  [0402_DSP]
R125  value 100k  Case/Package: 0402  [0402_DSP]
R126  value 100k  Case/Package: 0402  [0402_DSP]
R127  value 100k  Case/Package: 0402  [0402_DSP]
R128  value 100k  Case/Package: 0402  [0402_DSP]
R129  value 100k  Case/Package: 0402  [0402_DSP]
R130  value 100k  Case/Package: 0402  [0402_DSP]
R131  value 100k  Case/Package: 0402  [0402_DSP]
R132  value 100k  Case/Package: 0402  [0402_DSP]
R133  value 100k  Case/Package: 0402  [0402_DSP]
R134  value 100k  Case/Package: 0402  [0402_DSP]
R135  value 100k  Case/Package: 0402  [0402_DSP]
R136  value 100k  Case/Package: 0402  [0402_DSP]
R137  value 100k  Case/Package: 0402  [0402_DSP]
R138  value 100k  Case/Package: 0402  [0402_DSP]
R139  value 100k  Case/Package: 0402  [0402_DSP]
R140  value 4.99  Case/Package: 0402  [0402_DSP]
R141  value 3.3k  Case/Package: 0402  [0402_DSP]
R142  value 10k  Case/Package: 0402  [0402_DSP]
R143  value 100k  Case/Package: 0402  [0402_DSP]
R144  value 100k  Case/Package: 0402  [0402_DSP]
R145  value 100k  Case/Package: 0402  [0402_DSP]
R146  value 100k  Case/Package: 0402  [0402_DSP]
R147  value 100k  Case/Package: 0402  [0402_DSP]
R148  value 100k  Case/Package: 0402  [0402_DSP]
R149  value 100k  Case/Package: 0402  [0402_DSP]
R150  value 100k  Case/Package: 0402  [0402_DSP]
R151  value 100k  Case/Package: 0402  [0402_DSP]
R152  value 100k  Case/Package: 0402  [0402_DSP]
R153  value 100k  Case/Package: 0402  [0402_DSP]
R154  value 100k  Case/Package: 0402  [0402_DSP]
R155  value 100k  Case/Package: 0402  [0402_DSP]
R156  value 100k  Case/Package: 0402  [0402_DSP]
R157  value 100k  Case/Package: 0402  [0402_DSP]
R158  value 100k  Case/Package: 0402  [0402_DSP]
R161  value 10k  Case/Package: 0402  [0402_DSP]
R163  value 1k  Case/Package: 0402  [0402_DSP]
R164  value 17k  Case/Package: 0402  [0402_DSP]
R172  value 100k  Case/Package: 0402  [0402_DSP]
R173  value 3.3k  Case/Package: 0402  [0402_DSP]
R174  value 100k  Case/Package: 0402  [0402_DSP]
R175  value 3.3k  Case/Package: 0402  [0402_DSP]
R182  value 100k  Case/Package: 0402  [0402_DSP]
R183  value 100k  Case/Package: 0402  [0402_DSP]
R184  value 3.3k  Case/Package: 0402  [0402_DSP]
R188  value 10k  Case/Package: 0402  [0402_DSP]
R189  value 49.9  Case/Package: 0402  [0402_DSP]
R190  value 49.9  Case/Package: 0402  [0402_DSP]
TP1  (no value)  [TestPoint_4952]
TP2  (no value)  [TestPoint_4952]
TP3  (no value)  [TestPoint_4952]
TP4  (no value)  [TestPoint_4952]
TP5  (no value)  [TestPoint_4952]
TP6  (no value)  [TestPoint_4952]
TP7  (no value)  [TestPoint_4952]
TP8  (no value)  [TestPoint_4952]
TP9  (no value)  [TestPoint_4952]
TP10  (no value)  [TestPoint_4952]
TP16  (no value)  [TestPoint_4952]
TP17  (no value)  [TestPoint_4952]
TP18  (no value)  [TestPoint_4952]
TP19  (no value)  [TestPoint_4952]
U1  IC BUFFER INVERT 5.5V SOT23-5  [SOT95P280X145-5N]  (value not drawn)
U2  IC TRANSLTR BIDIRECTIONAL 8VSSOP  [SOP50P310X90-8N]  (value not drawn)
U3  74LVC1G14W5-7  [FP-SOT25-MFG]
U4  MCP2542FD-H_SN  [SOIC127P600X175-8N]
U5  LTC4412HVIS6#TRPBF  [LT-S6-6-TSOT-23_L]
U6  IC REG BUCK ADJ 1A DL 16MSOP  [SOP50P490X110-17N]
U7  74LVC1G14W5-7  [FP-SOT25-MFG]
U8  LTC4412HVIS6#TRPBF  [LT-S6-6-TSOT-23_L]
U9  SENSOR Magnetometer WHEAT BRDG 8SOIC  [SOIC127P600X175-8N]
U10  IC INST AMP 1 CIRCUIT 8MSOP  [SOP65P490X110-8N]  (value not drawn)
U11  LTC4412HVIS6#TRPBF  [LT-S6-6-TSOT-23_L]
U12  LTC4412HVIS6#TRPBF  [LT-S6-6-TSOT-23_L]
U13  ADXL373Z_Eval  [ADXL373Z_EVAL]
U14  MMC5983_EVAL  [MMC5983_EVAL]
U15  MT25QL128ABA8ESF-0AAT  [SOIC127P1032X265-16N]
U16  MCP6402-H/SN  [SOIC-SN8_L]  (parts A,B of 2)
U17  MT25QL128ABA8ESF-0AAT  [SOIC127P1032X265-16N]
U18  MT25QL128ABA8ESF-0AAT  [SOIC127P1032X265-16N]
U19  MT25QL128ABA8ESF-0AAT  [SOIC127P1032X265-16N]
U20  Manufacturer_Part_Number: MCP6401T-E/OT  [SOT95P270X145-5N]  (hidden comment: IC OPAMP GP 1 CIRCUIT SOT23-5)
U21  MT25QL128ABA8ESF-0AAT  [SOIC127P1032X265-16N]
U22  MT25QL128ABA8ESF-0AAT  [SOIC127P1032X265-16N]
U23  MT25QL128ABA8ESF-0AAT  [SOIC127P1032X265-16N]
U24  IC SWITCH SPDTX1 600MOHM SC70-6  [SOT65P210X110-6N]  (value not drawn)
U25  MT25QL128ABA8ESF-0AAT  [SOIC127P1032X265-16N]
U26  MCP6402-H/SN  [SOIC-SN8_L]  (parts A,B of 2)
U27  IC BUFFER INVERT 5.5V SOT23-5  [SOT95P280X145-5N]  (value not drawn)
U28  MT25QL128ABA8ESF-0AAT  [SOIC127P1032X265-16N]
U29  MT25QL128ABA8ESF-0AAT  [SOIC127P1032X265-16N]
U30  MT25QL128ABA8ESF-0AAT  [SOIC127P1032X265-16N]
U31  MT25QL128ABA8ESF-0AAT  [SOIC127P1032X265-16N]
U32  IC VREF SERIES 0.08% 8SOIC  [SOIC127P600X175-8N]  (value not drawn)
U33  IC ADC 12BIT SAR 20TSSOP  [SOP65P640X120-20N]  (value not drawn)
U34  MT25QL128ABA8ESF-0AAT  [SOIC127P1032X265-16N]
U35  MT25QL128ABA8ESF-0AAT  [SOIC127P1032X265-16N]
U36  MT25QL128ABA8ESF-0AAT  [SOIC127P1032X265-16N]
U37  MT25QL128ABA8ESF-0AAT  [SOIC127P1032X265-16N]
U38  ADG732BCPZ  [QFN50P700X700X100-49N-D]
U39  23LC1024-E/SN  [FP-C04-057-SN-IPC_A]
U40  MT25QL128ABA8ESF-0AAT  [SOIC127P1032X265-16N]
U41  MT25QL128ABA8ESF-0AAT  [SOIC127P1032X265-16N]
U42  MT25QL128ABA8ESF-0AAT  [SOIC127P1032X265-16N]
U43  MT25QL128ABA8ESF-0AAT  [SOIC127P1032X265-16N]
U44  DSPIC33CK512MP605-I/PT  [QFP50P900X900X120-48N]
U45  MT25QL128ABA8ESF-0AAT  [SOIC127P1032X265-16N]
U46  MT25QL128ABA8ESF-0AAT  [SOIC127P1032X265-16N]
U47  MT25QL128ABA8ESF-0AAT  [SOIC127P1032X265-16N]
U48  MT25QL128ABA8ESF-0AAT  [SOIC127P1032X265-16N]
U50  MCP6402-H/SN  [SOIC-SN8_L]  (parts A,B of 2)
Y1  Oscillators 8Mhz  [SIT8920BM1133S8000000G]

### Ports
3V3 (see SAST_PCB_V2B_Test_Beta_Main[2B], SAST_PCB_V2B_Test_Beta_Main[2C]), 3V3_MAG_1 (see SAST_PCB_V2B_Test_Beta_Main[5C], SAST_PCB_V2B_Test_Beta_Main[6C]), 3V3_SWH (see SAST_PCB_V2B_Test_Beta_Main[6A]), 3V3_SWH (see SAST_PCB_V2B_Test_Beta_Main[9D]), 3V3_SWL (see SAST_PCB_V2B_Test_Beta_Main[8C]), 3V3_SWL (see SAST_PCB_V2B_Test_Beta_Main[9D]), 5V_IN (see SAST_PCB_V2B_Test_Beta_Main[1A]), 5V_IN (see SAST_PCB_V2B_Test_Beta_Main[2B]), 5V_IN_FUSED (see SAST_PCB_V2B_Test_Beta_Main[2A]), 5V_IN_FUSED (see SAST_PCB_V2B_Test_Beta_Main[4B]), 5V_SW (see SAST_PCB_V2B_Test_Beta_Main[2B], SAST_PCB_V2B_Test_Beta_Main[2D], SAST_PCB_V2B_Test_Beta_Main[9D], SAST_PCB_V2B_Test_Beta_Main[10A]), 5V_SW (see SAST_PCB_V2B_Test_Beta_Main[2B], SAST_PCB_V2B_Test_Beta_Main[2D], SAST_PCB_V2B_Test_Beta_Main[9D], SAST_PCB_V2B_Test_Beta_Main[12A]), 5V_SW (see SAST_PCB_V2B_Test_Beta_Main[2B], SAST_PCB_V2B_Test_Beta_Main[2D], SAST_PCB_V2B_Test_Beta_Main[10A], SAST_PCB_V2B_Test_Beta_Main[12A]), 5V_SW (see SAST_PCB_V2B_Test_Beta_Main[2B], SAST_PCB_V2B_Test_Beta_Main[9D], SAST_PCB_V2B_Test_Beta_Main[10A], SAST_PCB_V2B_Test_Beta_Main[12A]), 5V_SW (see SAST_PCB_V2B_Test_Beta_Main[2D], SAST_PCB_V2B_Test_Beta_Main[9D], SAST_PCB_V2B_Test_Beta_Main[10A], SAST_PCB_V2B_Test_Beta_Main[12A]), ADC_REF_2500 (see SAST_PCB_V2B_Test_Beta_Main[6B]), ADC_REF_2500 (see SAST_PCB_V2B_Test_Beta_Main[7B]), BAT1 (see SAST_PCB_V2B_Test_Beta_Main[1A]), BAT1 (see SAST_PCB_V2B_Test_Beta_Main[2A]), BAT2 (see SAST_PCB_V2B_Test_Beta_Main[1A]), BAT2 (see SAST_PCB_V2B_Test_Beta_Main[2A]), BAT3 (see SAST_PCB_V2B_Test_Beta_Main[1A]), BAT3 (see SAST_PCB_V2B_Test_Beta_Main[2A]), CAN_Enable (see SAST_PCB_V2B_Test_Beta_Main[7D]), CAN_Enable (see SAST_PCB_V2B_Test_Beta_Main[11A]), CAN_IN_FUSED (see SAST_PCB_V2B_Test_Beta_Main[3A]), CAN_IN_FUSED (see SAST_PCB_V2B_Test_Beta_Main[4B]), CAN_PWR (see SAST_PCB_V2B_Test_Beta_Main[2A]), CAN_PWR (see SAST_PCB_V2B_Test_Beta_Main[2B]), CAN_RXD (out, see SAST_PCB_V2B_Test_Beta_Main[5D]), CAN_RXD (out, see SAST_PCB_V2B_Test_Beta_Main[12A]), CAN_TXD (in, see SAST_PCB_V2B_Test_Beta_Main[5D]), CAN_TXD (out, see SAST_PCB_V2B_Test_Beta_Main[12A]), CANH (bidir, see SAST_PCB_V2B_Test_Beta_Main[2B]), CANH (bidir, see SAST_PCB_V2B_Test_Beta_Main[13A]), CANL (bidir, see SAST_PCB_V2B_Test_Beta_Main[2B]), CANL (bidir, see SAST_PCB_V2B_Test_Beta_Main[13A]), COM_OVERRIDE (see SAST_PCB_V2B_Test_Beta_Main[8A], SAST_PCB_V2B_Test_Beta_Main[8B]), COM_OVERRIDE (see SAST_PCB_V2B_Test_Beta_Main[8A], SAST_PCB_V2B_Test_Beta_Main[9A]), COM_OVERRIDE (see SAST_PCB_V2B_Test_Beta_Main[8B], SAST_PCB_V2B_Test_Beta_Main[9A]), COM_SW (see SAST_PCB_V2B_Test_Beta_Main[7B]), COM_SW (see SAST_PCB_V2B_Test_Beta_Main[7D]), CS_4K_Gyro (see SAST_PCB_V2B_Test_Beta_Main[2C]), CS_4K_Gyro (see SAST_PCB_V2B_Test_Beta_Main[5D]), CS_CONT (see SAST_PCB_V2B_Test_Beta_Main[7D]), CS_CONT (see SAST_PCB_V2B_Test_Beta_Main[8C]), CS_GYRO (see SAST_PCB_V2B_Test_Beta_Main[2B]), CS_GYRO (see SAST_PCB_V2B_Test_Beta_Main[7D]), CS_HG1 (see SAST_PCB_V2B_Test_Beta_Main[7D]), CS_HG1 (see SAST_PCB_V2B_Test_Beta_Main[9C]), CS_LG1 (see SAST_PCB_V2B_Test_Beta_Main[2C]), CS_LG1 (see SAST_PCB_V2B_Test_Beta_Main[7D]), CS_LG2 (see SAST_PCB_V2B_Test_Beta_Main[2C]), CS_LG2 (see SAST_PCB_V2B_Test_Beta_Main[7D]), CS_MAG (see SAST_PCB_V2B_Test_Beta_Main[7D]), CS_MAG (see SAST_PCB_V2B_Test_Beta_Main[14A]), CS_MEM1 (see SAST_PCB_V2B_Test_Beta_Main[8C]), CS_MEM1 (see SAST_PCB_V2B_Test_Beta_Main[10B]), CS_MEM2 (see SAST_PCB_V2B_Test_Beta_Main[8C]), CS_MEM2 (see SAST_PCB_V2B_Test_Beta_Main[10B]), CS_MEM3 (see SAST_PCB_V2B_Test_Beta_Main[8C]), CS_MEM3 (see SAST_PCB_V2B_Test_Beta_Main[10C]), CS_MEM4 (see SAST_PCB_V2B_Test_Beta_Main[8C]), CS_MEM4 (see SAST_PCB_V2B_Test_Beta_Main[10C]), CS_MEM5 (see SAST_PCB_V2B_Test_Beta_Main[8C]), CS_MEM5 (see SAST_PCB_V2B_Test_Beta_Main[10D]), CS_MEM6 (see SAST_PCB_V2B_Test_Beta_Main[8C]), CS_MEM6 (see SAST_PCB_V2B_Test_Beta_Main[10D]), CS_MEM7 (see SAST_PCB_V2B_Test_Beta_Main[8C]), CS_MEM7 (see SAST_PCB_V2B_Test_Beta_Main[11B]), CS_MEM8 (see SAST_PCB_V2B_Test_Beta_Main[8C]), CS_MEM8 (see SAST_PCB_V2B_Test_Beta_Main[11B]), CS_MEM9 (see SAST_PCB_V2B_Test_Beta_Main[8C]), CS_MEM9 (see SAST_PCB_V2B_Test_Beta_Main[11C]), CS_MEM10 (see SAST_PCB_V2B_Test_Beta_Main[8C]), CS_MEM10 (see SAST_PCB_V2B_Test_Beta_Main[11C]), CS_MEM11 (see SAST_PCB_V2B_Test_Beta_Main[8C]), CS_MEM11 (see SAST_PCB_V2B_Test_Beta_Main[11D]), CS_MEM12 (see SAST_PCB_V2B_Test_Beta_Main[8C]), CS_MEM12 (see SAST_PCB_V2B_Test_Beta_Main[11D]), CS_MEM13 (see SAST_PCB_V2B_Test_Beta_Main[8C]), CS_MEM13 (see SAST_PCB_V2B_Test_Beta_Main[13B]), CS_MEM14 (see SAST_PCB_V2B_Test_Beta_Main[8C]), CS_MEM14 (see SAST_PCB_V2B_Test_Beta_Main[13B]), CS_MEM15 (see SAST_PCB_V2B_Test_Beta_Main[8C]), CS_MEM15 (see SAST_PCB_V2B_Test_Beta_Main[13C]), CS_MEM16 (see SAST_PCB_V2B_Test_Beta_Main[9C]), CS_MEM16 (see SAST_PCB_V2B_Test_Beta_Main[13C]), CS_MEM17 (see SAST_PCB_V2B_Test_Beta_Main[9C]), CS_MEM17 (see SAST_PCB_V2B_Test_Beta_Main[13D]), CS_MEM18 (see SAST_PCB_V2B_Test_Beta_Main[9C]), CS_MEM18 (see SAST_PCB_V2B_Test_Beta_Main[13D]), CS_MEM19 (see SAST_PCB_V2B_Test_Beta_Main[9C]), CS_MEM19 (see SAST_PCB_V2B_Test_Beta_Main[15B]), CS_MEM20 (see SAST_PCB_V2B_Test_Beta_Main[9C]), CS_MEM20 (see SAST_PCB_V2B_Test_Beta_Main[15B]), CS_MEM21 (see SAST_PCB_V2B_Test_Beta_Main[9C]), CS_MEM21 (see SAST_PCB_V2B_Test_Beta_Main[15C]), CS_MEM22 (see SAST_PCB_V2B_Test_Beta_Main[9C]), CS_MEM22 (see SAST_PCB_V2B_Test_Beta_Main[15C]), CS_MEM23 (see SAST_PCB_V2B_Test_Beta_Main[9C]), CS_MEM23 (see SAST_PCB_V2B_Test_Beta_Main[15D]), CS_MEM24 (see SAST_PCB_V2B_Test_Beta_Main[9C]), CS_MEM24 (see SAST_PCB_V2B_Test_Beta_Main[15D]), CS_SRAM1 (see SAST_PCB_V2B_Test_Beta_Main[1D]), CS_SRAM1 (see SAST_PCB_V2B_Test_Beta_Main[7D]), CS_VOLT (see SAST_PCB_V2B_Test_Beta_Main[7D]), CS_VOLT (see SAST_PCB_V2B_Test_Beta_Main[8B]), CTL_CS_A0 (see SAST_PCB_V2B_Test_Beta_Main[5D]), CTL_CS_A0 (see SAST_PCB_V2B_Test_Beta_Main[8C]), CTL_CS_A1 (see SAST_PCB_V2B_Test_Beta_Main[5D]), CTL_CS_A1 (see SAST_PCB_V2B_Test_Beta_Main[8C]), CTL_CS_A2 (see SAST_PCB_V2B_Test_Beta_Main[5D]), CTL_CS_A2 (see SAST_PCB_V2B_Test_Beta_Main[8C]), CTL_CS_A3 (see SAST_PCB_V2B_Test_Beta_Main[5D]), CTL_CS_A3 (see SAST_PCB_V2B_Test_Beta_Main[8C]), CTL_CS_A4 (see SAST_PCB_V2B_Test_Beta_Main[5D]), CTL_CS_A4 (see SAST_PCB_V2B_Test_Beta_Main[8C]), GND (see SAST_PCB_V2B_Test_Beta_Main[2B], SAST_PCB_V2B_Test_Beta_Main[2C]), GND (see SAST_PCB_V2B_Test_Beta_Main[2B], SAST_PCB_V2B_Test_Beta_Main[2C], SAST_PCB_V2B_Test_Beta_Main[2D]), GND (see SAST_PCB_V2B_Test_Beta_Main[2B], SAST_PCB_V2B_Test_Beta_Main[2D]), Gyro_CONV (see SAST_PCB_V2B_Test_Beta_Main[2B]), Gyro_CONV (see SAST_PCB_V2B_Test_Beta_Main[5D]), Gyro_Ref_2048 (see SAST_PCB_V2B_Test_Beta_Main[2B]), Gyro_Ref_2048 (see SAST_PCB_V2B_Test_Beta_Main[4C]), Gyro_Ref_4096 (see SAST_PCB_V2B_Test_Beta_Main[2B]), Gyro_Ref_4096 (see SAST_PCB_V2B_Test_Beta_Main[4C]), Int_4K_Gyro (see SAST_PCB_V2B_Test_Beta_Main[2C]), Int_4K_Gyro (see SAST_PCB_V2B_Test_Beta_Main[7D]), INT_Alert_2 (see SAST_PCB_V2B_Test_Beta_Main[5D]), INT_Alert_2 (see SAST_PCB_V2B_Test_Beta_Main[8C]), MAG_ANAL_1 (see SAST_PCB_V2B_Test_Beta_Main[6B]), MAG_ANAL_1 (see SAST_PCB_V2B_Test_Beta_Main[6C]), MAG_ANAL_2 (see SAST_PCB_V2B_Test_Beta_Main[2C]), MAG_ANAL_2 (see SAST_PCB_V2B_Test_Beta_Main[6B]), MCLR (see SAST_PCB_V2B_Test_Beta_Main[2D]), MCLR (see SAST_PCB_V2B_Test_Beta_Main[6D]), MISO1 (see SAST_PCB_V2B_Test_Beta_Main[2B], SAST_PCB_V2B_Test_Beta_Main[3D], SAST_PCB_V2B_Test_Beta_Main[7D], SAST_PCB_V2B_Test_Beta_Main[8B], SAST_PCB_V2B_Test_Beta_Main[9B]), MISO1 (see SAST_PCB_V2B_Test_Beta_Main[2B], SAST_PCB_V2B_Test_Beta_Main[3D], SAST_PCB_V2B_Test_Beta_Main[7D], SAST_PCB_V2B_Test_Beta_Main[8B], SAST_PCB_V2B_Test_Beta_Main[15A]), MISO1 (see SAST_PCB_V2B_Test_Beta_Main[2B], SAST_PCB_V2B_Test_Beta_Main[3D], SAST_PCB_V2B_Test_Beta_Main[7D], SAST_PCB_V2B_Test_Beta_Main[9B], SAST_PCB_V2B_Test_Beta_Main[15A]), MISO1 (see SAST_PCB_V2B_Test_Beta_Main[2B], SAST_PCB_V2B_Test_Beta_Main[3D], SAST_PCB_V2B_Test_Beta_Main[8B], SAST_PCB_V2B_Test_Beta_Main[9B], SAST_PCB_V2B_Test_Beta_Main[15A]), MISO1 (see SAST_PCB_V2B_Test_Beta_Main[2B], SAST_PCB_V2B_Test_Beta_Main[7D], SAST_PCB_V2B_Test_Beta_Main[8B], SAST_PCB_V2B_Test_Beta_Main[9B], SAST_PCB_V2B_Test_Beta_Main[15A]), MISO1 (see SAST_PCB_V2B_Test_Beta_Main[3D], SAST_PCB_V2B_Test_Beta_Main[7D], SAST_PCB_V2B_Test_Beta_Main[8B], SAST_PCB_V2B_Test_Beta_Main[9B], SAST_PCB_V2B_Test_Beta_Main[15A]), MISO2 (see SAST_PCB_V2B_Test_Beta_Main[2C]), MISO2 (see SAST_PCB_V2B_Test_Beta_Main[5D]), MISO (see SAST_PCB_V2B_Test_Beta_Main[7D], SAST_PCB_V2B_Test_Beta_Main[11B], SAST_PCB_V2B_Test_Beta_Main[11C], SAST_PCB_V2B_Test_Beta_Main[11D], SAST_PCB_V2B_Test_Beta_Main[13B], SAST_PCB_V2B_Test_Beta_Main[13C], SAST_PCB_V2B_Test_Beta_Main[13D], SAST_PCB_V2B_Test_Beta_Main[14B], SAST_PCB_V2B_Test_Beta_Main[14C], SAST_PCB_V2B_Test_Beta_Main[14D], SAST_PCB_V2B_Test_Beta_Main[16B], SAST_PCB_V2B_Test_Beta_Main[16C], SAST_PCB_V2B_Test_Beta_Main[16D]), MISO (see SAST_PCB_V2B_Test_Beta_Main[11B], SAST_PCB_V2B_Test_Beta_Main[11C], SAST_PCB_V2B_Test_Beta_Main[11D], SAST_PCB_V2B_Test_Beta_Main[13B], SAST_PCB_V2B_Test_Beta_Main[13C], SAST_PCB_V2B_Test_Beta_Main[13D], SAST_PCB_V2B_Test_Beta_Main[14B], SAST_PCB_V2B_Test_Beta_Main[14C], SAST_PCB_V2B_Test_Beta_Main[14D], SAST_PCB_V2B_Test_Beta_Main[16B], SAST_PCB_V2B_Test_Beta_Main[16C], SAST_PCB_V2B_Test_Beta_Main[16D]), MOSI1 (see SAST_PCB_V2B_Test_Beta_Main[2C], SAST_PCB_V2B_Test_Beta_Main[3D], SAST_PCB_V2B_Test_Beta_Main[7D], SAST_PCB_V2B_Test_Beta_Main[8B], SAST_PCB_V2B_Test_Beta_Main[9B]), MOSI1 (see SAST_PCB_V2B_Test_Beta_Main[2C], SAST_PCB_V2B_Test_Beta_Main[3D], SAST_PCB_V2B_Test_Beta_Main[7D], SAST_PCB_V2B_Test_Beta_Main[8B], SAST_PCB_V2B_Test_Beta_Main[15A]), MOSI1 (see SAST_PCB_V2B_Test_Beta_Main[2C], SAST_PCB_V2B_Test_Beta_Main[3D], SAST_PCB_V2B_Test_Beta_Main[7D], SAST_PCB_V2B_Test_Beta_Main[9B], SAST_PCB_V2B_Test_Beta_Main[15A]), MOSI1 (see SAST_PCB_V2B_Test_Beta_Main[2C], SAST_PCB_V2B_Test_Beta_Main[3D], SAST_PCB_V2B_Test_Beta_Main[8B], SAST_PCB_V2B_Test_Beta_Main[9B], SAST_PCB_V2B_Test_Beta_Main[15A]), MOSI1 (see SAST_PCB_V2B_Test_Beta_Main[2C], SAST_PCB_V2B_Test_Beta_Main[7D], SAST_PCB_V2B_Test_Beta_Main[8B], SAST_PCB_V2B_Test_Beta_Main[9B], SAST_PCB_V2B_Test_Beta_Main[15A]), MOSI1 (see SAST_PCB_V2B_Test_Beta_Main[3D], SAST_PCB_V2B_Test_Beta_Main[7D], SAST_PCB_V2B_Test_Beta_Main[8B], SAST_PCB_V2B_Test_Beta_Main[9B], SAST_PCB_V2B_Test_Beta_Main[15A]), MOSI2 (see SAST_PCB_V2B_Test_Beta_Main[2C]), MOSI2 (see SAST_PCB_V2B_Test_Beta_Main[5D]), MOSI (see SAST_PCB_V2B_Test_Beta_Main[7D], SAST_PCB_V2B_Test_Beta_Main[11B], SAST_PCB_V2B_Test_Beta_Main[11C], SAST_PCB_V2B_Test_Beta_Main[11D], SAST_PCB_V2B_Test_Beta_Main[13B], SAST_PCB_V2B_Test_Beta_Main[13C], SAST_PCB_V2B_Test_Beta_Main[13D], SAST_PCB_V2B_Test_Beta_Main[14B], SAST_PCB_V2B_Test_Beta_Main[14C], SAST_PCB_V2B_Test_Beta_Main[14D], SAST_PCB_V2B_Test_Beta_Main[16B], SAST_PCB_V2B_Test_Beta_Main[16C], SAST_PCB_V2B_Test_Beta_Main[16D]), MOSI (see SAST_PCB_V2B_Test_Beta_Main[11B], SAST_PCB_V2B_Test_Beta_Main[11C], SAST_PCB_V2B_Test_Beta_Main[11D], SAST_PCB_V2B_Test_Beta_Main[13B], SAST_PCB_V2B_Test_Beta_Main[13C], SAST_PCB_V2B_Test_Beta_Main[13D], SAST_PCB_V2B_Test_Beta_Main[14B], SAST_PCB_V2B_Test_Beta_Main[14C], SAST_PCB_V2B_Test_Beta_Main[14D], SAST_PCB_V2B_Test_Beta_Main[16B], SAST_PCB_V2B_Test_Beta_Main[16C], SAST_PCB_V2B_Test_Beta_Main[16D]), OSC (see SAST_PCB_V2B_Test_Beta_Main[4D]), OSC (see SAST_PCB_V2B_Test_Beta_Main[5D]), PGEC1 (see SAST_PCB_V2B_Test_Beta_Main[2D]), PGEC1 (see SAST_PCB_V2B_Test_Beta_Main[5D]), PGED1 (see SAST_PCB_V2B_Test_Beta_Main[2D]), PGED1 (see SAST_PCB_V2B_Test_Beta_Main[5D]), POWER_SW (see SAST_PCB_V2B_Test_Beta_Main[2C], SAST_PCB_V2B_Test_Beta_Main[4D], SAST_PCB_V2B_Test_Beta_Main[7D], SAST_PCB_V2B_Test_Beta_Main[8D]), POWER_SW (see SAST_PCB_V2B_Test_Beta_Main[2C], SAST_PCB_V2B_Test_Beta_Main[4D], SAST_PCB_V2B_Test_Beta_Main[8D]), POWER_SW (see SAST_PCB_V2B_Test_Beta_Main[2C], SAST_PCB_V2B_Test_Beta_Main[7D], SAST_PCB_V2B_Test_Beta_Main[8D]), POWER_SW (see SAST_PCB_V2B_Test_Beta_Main[4D], SAST_PCB_V2B_Test_Beta_Main[7D], SAST_PCB_V2B_Test_Beta_Main[8D]), QBUS (see SAST_PCB_V2B_Test_Beta_Main[1A]), QBUS (see SAST_PCB_V2B_Test_Beta_Main[11A]), SCK1 (see SAST_PCB_V2B_Test_Beta_Main[2C], SAST_PCB_V2B_Test_Beta_Main[2D], SAST_PCB_V2B_Test_Beta_Main[7D], SAST_PCB_V2B_Test_Beta_Main[8B], SAST_PCB_V2B_Test_Beta_Main[9B]), SCK1 (see SAST_PCB_V2B_Test_Beta_Main[2C], SAST_PCB_V2B_Test_Beta_Main[2D], SAST_PCB_V2B_Test_Beta_Main[7D], SAST_PCB_V2B_Test_Beta_Main[8B], SAST_PCB_V2B_Test_Beta_Main[15A]), SCK1 (see SAST_PCB_V2B_Test_Beta_Main[2C], SAST_PCB_V2B_Test_Beta_Main[2D], SAST_PCB_V2B_Test_Beta_Main[7D], SAST_PCB_V2B_Test_Beta_Main[9B], SAST_PCB_V2B_Test_Beta_Main[15A]), SCK1 (see SAST_PCB_V2B_Test_Beta_Main[2C], SAST_PCB_V2B_Test_Beta_Main[2D], SAST_PCB_V2B_Test_Beta_Main[8B], SAST_PCB_V2B_Test_Beta_Main[9B], SAST_PCB_V2B_Test_Beta_Main[15A]), SCK1 (see SAST_PCB_V2B_Test_Beta_Main[2C], SAST_PCB_V2B_Test_Beta_Main[7D], SAST_PCB_V2B_Test_Beta_Main[8B], SAST_PCB_V2B_Test_Beta_Main[9B], SAST_PCB_V2B_Test_Beta_Main[15A]), SCK1 (see SAST_PCB_V2B_Test_Beta_Main[2D], SAST_PCB_V2B_Test_Beta_Main[7D], SAST_PCB_V2B_Test_Beta_Main[8B], SAST_PCB_V2B_Test_Beta_Main[9B], SAST_PCB_V2B_Test_Beta_Main[15A]), SCK2 (see SAST_PCB_V2B_Test_Beta_Main[2C]), SCK2 (see SAST_PCB_V2B_Test_Beta_Main[5D]), SCK (see SAST_PCB_V2B_Test_Beta_Main[7D], SAST_PCB_V2B_Test_Beta_Main[10B], SAST_PCB_V2B_Test_Beta_Main[10C], SAST_PCB_V2B_Test_Beta_Main[10D], SAST_PCB_V2B_Test_Beta_Main[12B], SAST_PCB_V2B_Test_Beta_Main[12C], SAST_PCB_V2B_Test_Beta_Main[12D], SAST_PCB_V2B_Test_Beta_Main[13B], SAST_PCB_V2B_Test_Beta_Main[13C], SAST_PCB_V2B_Test_Beta_Main[13D], SAST_PCB_V2B_Test_Beta_Main[15B], SAST_PCB_V2B_Test_Beta_Main[15C], SAST_PCB_V2B_Test_Beta_Main[15D]), SCK (see SAST_PCB_V2B_Test_Beta_Main[10B], SAST_PCB_V2B_Test_Beta_Main[10C], SAST_PCB_V2B_Test_Beta_Main[10D], SAST_PCB_V2B_Test_Beta_Main[12B], SAST_PCB_V2B_Test_Beta_Main[12C], SAST_PCB_V2B_Test_Beta_Main[12D], SAST_PCB_V2B_Test_Beta_Main[13B], SAST_PCB_V2B_Test_Beta_Main[13C], SAST_PCB_V2B_Test_Beta_Main[13D], SAST_PCB_V2B_Test_Beta_Main[15B], SAST_PCB_V2B_Test_Beta_Main[15C], SAST_PCB_V2B_Test_Beta_Main[15D]), UART1_RX_3V3 (see SAST_PCB_V2B_Test_Beta_Main[4D]), UART1_RX_3V3 (see SAST_PCB_V2B_Test_Beta_Main[6A]), UART1_RX_5V (see SAST_PCB_V2B_Test_Beta_Main[8A]), UART1_RX_5V (see SAST_PCB_V2B_Test_Beta_Main[8B]), UART1_TX_3V3 (see SAST_PCB_V2B_Test_Beta_Main[4D]), UART1_TX_3V3 (see SAST_PCB_V2B_Test_Beta_Main[6A]), UART1_TX_5V (see SAST_PCB_V2B_Test_Beta_Main[8A]), UART1_TX_5V (see SAST_PCB_V2B_Test_Beta_Main[9A]), UART2_RX_3V3 (see SAST_PCB_V2B_Test_Beta_Main[2B], SAST_PCB_V2B_Test_Beta_Main[2C]), UART2_RX_3V3 (see SAST_PCB_V2B_Test_Beta_Main[2B], SAST_PCB_V2B_Test_Beta_Main[5D]), UART2_RX_3V3 (see SAST_PCB_V2B_Test_Beta_Main[2C], SAST_PCB_V2B_Test_Beta_Main[5D]), UART2_TX_3V3 (see SAST_PCB_V2B_Test_Beta_Main[2B], SAST_PCB_V2B_Test_Beta_Main[2C], SAST_PCB_V2B_Test_Beta_Main[5D]), UART2_TX_3V3 (see SAST_PCB_V2B_Test_Beta_Main[2B], SAST_PCB_V2B_Test_Beta_Main[5D]), UART2_TX_3V3 (see SAST_PCB_V2B_Test_Beta_Main[2C], SAST_PCB_V2B_Test_Beta_Main[5D]), UART_DT_RX_5V_EXT (see SAST_PCB_V2B_Test_Beta_Main[1A]), UART_DT_RX_5V_EXT (see SAST_PCB_V2B_Test_Beta_Main[8A]), UART_DT_TX_5V_EXT (see SAST_PCB_V2B_Test_Beta_Main[1A]), UART_DT_TX_5V_EXT (see SAST_PCB_V2B_Test_Beta_Main[8A]), VBAT1, VBAT2, VBAT3, VOLT_IN_5V (see SAST_PCB_V2B_Test_Beta_Main[4B]), VOLT_IN_5V (see SAST_PCB_V2B_Test_Beta_Main[5A]), VOLT_IN_BAT (see SAST_PCB_V2B_Test_Beta_Main[4B]), VOLT_IN_BAT (see SAST_PCB_V2B_Test_Beta_Main[5A]), XTAL_ENABLE (see SAST_PCB_V2B_Test_Beta_Main[3D]), XTAL_ENABLE (see SAST_PCB_V2B_Test_Beta_Main[5D])